# EAGLE board pcie-host (EAGLE 8.3.2), part 1 of 2
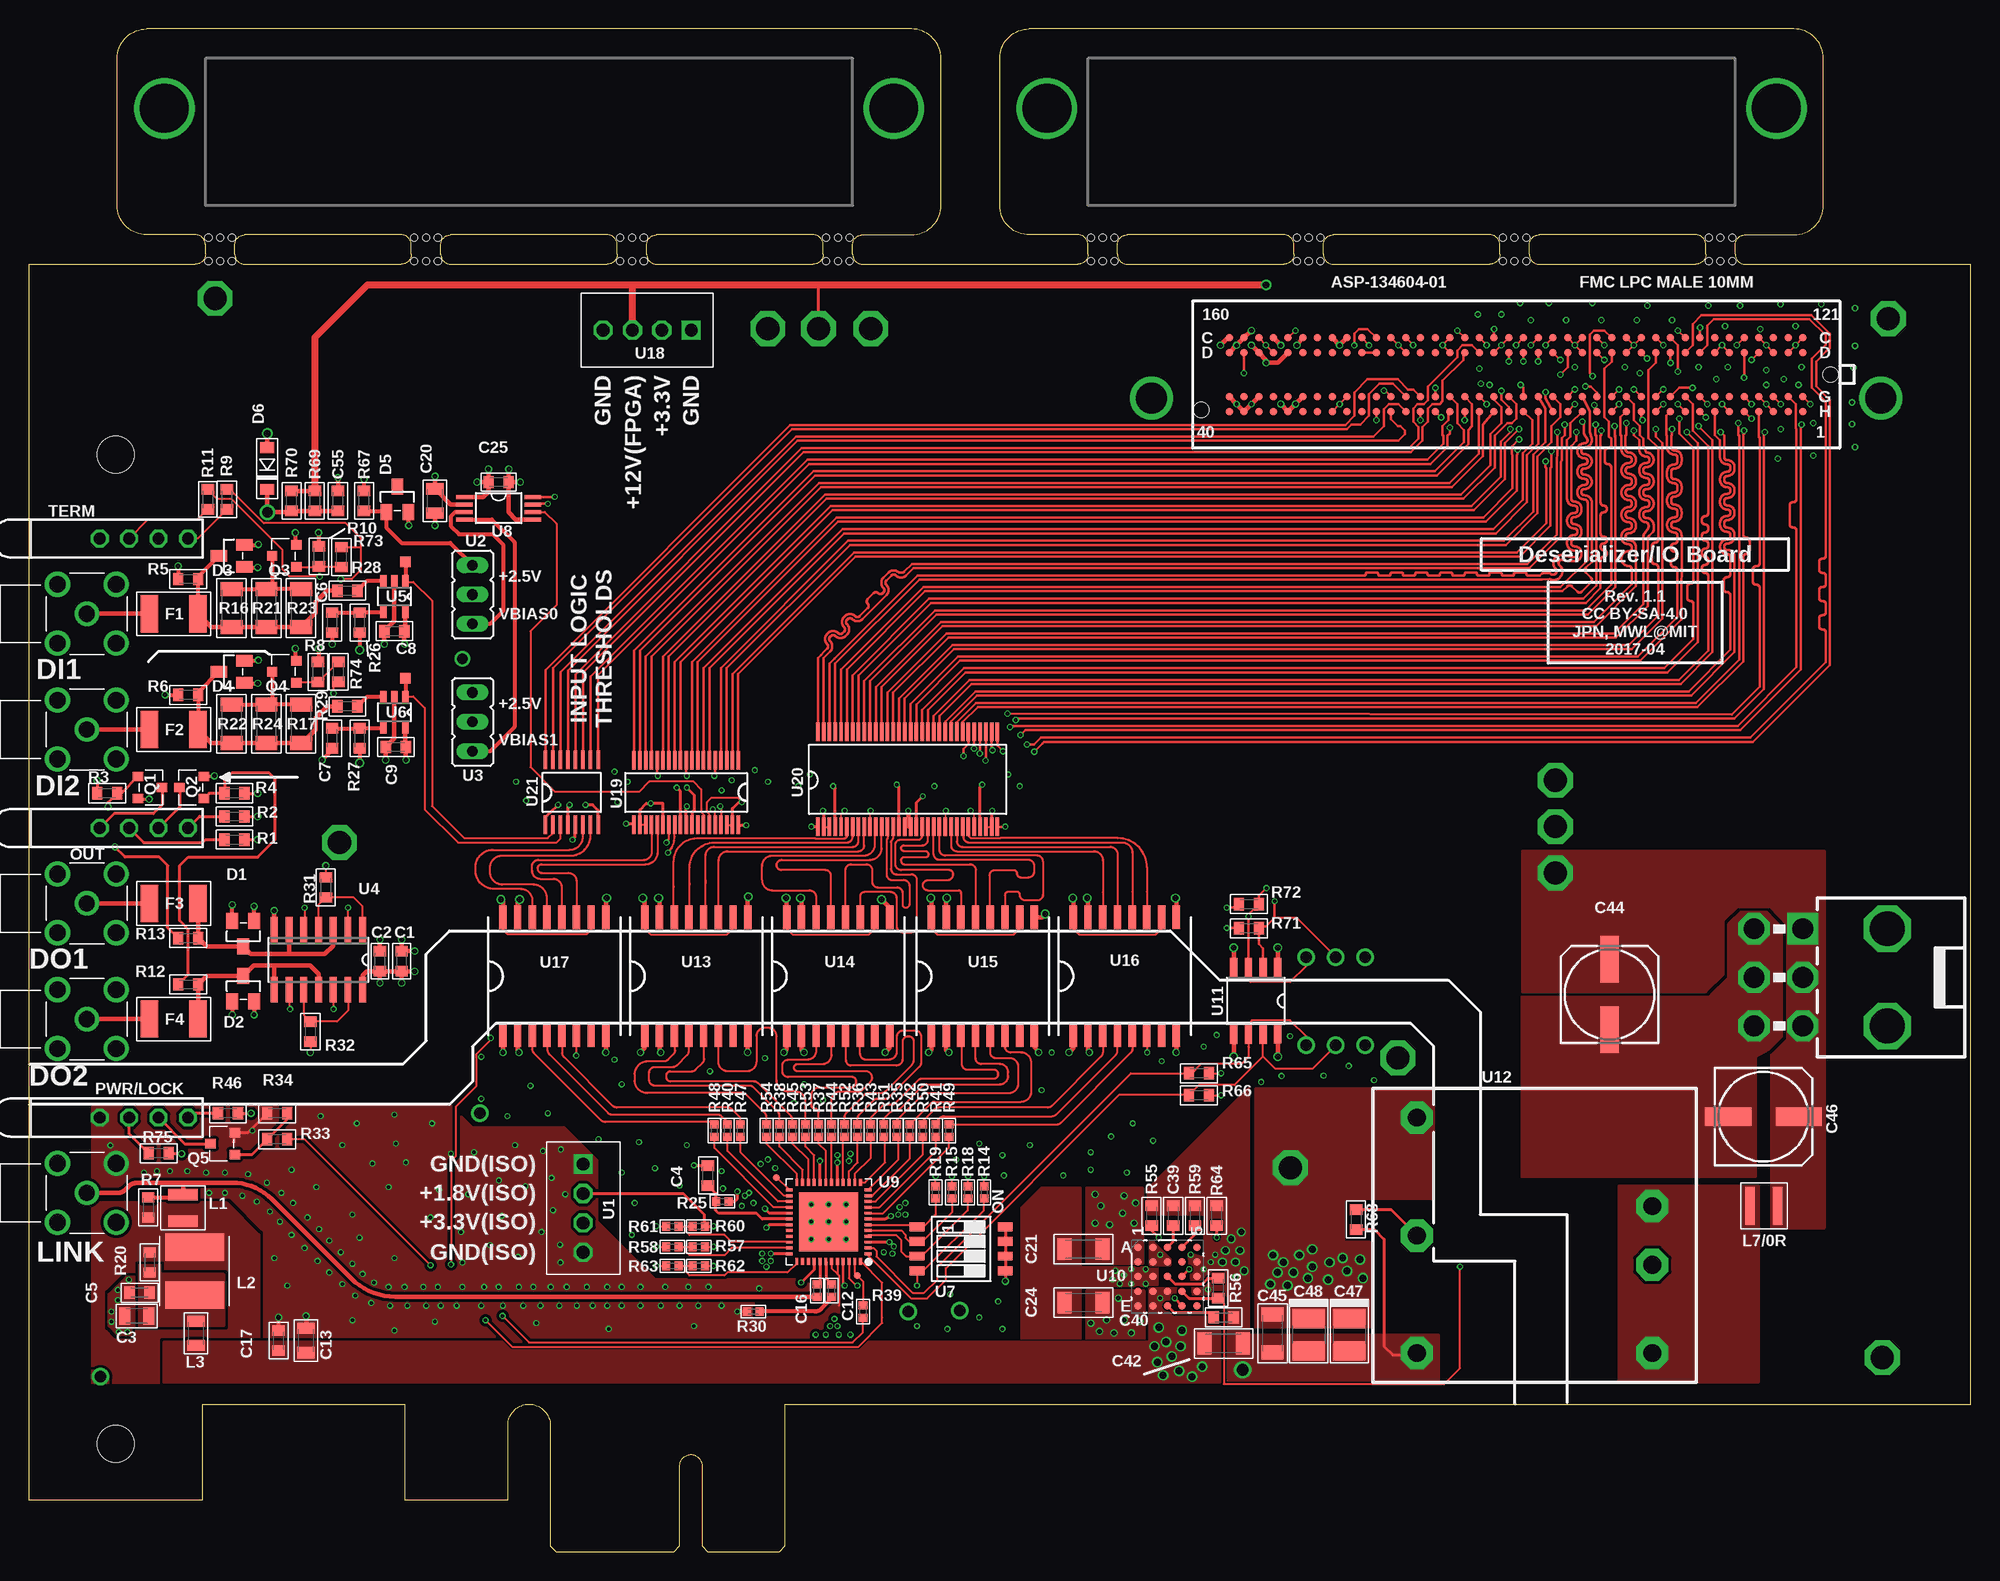
[diagram p5: board, top side]
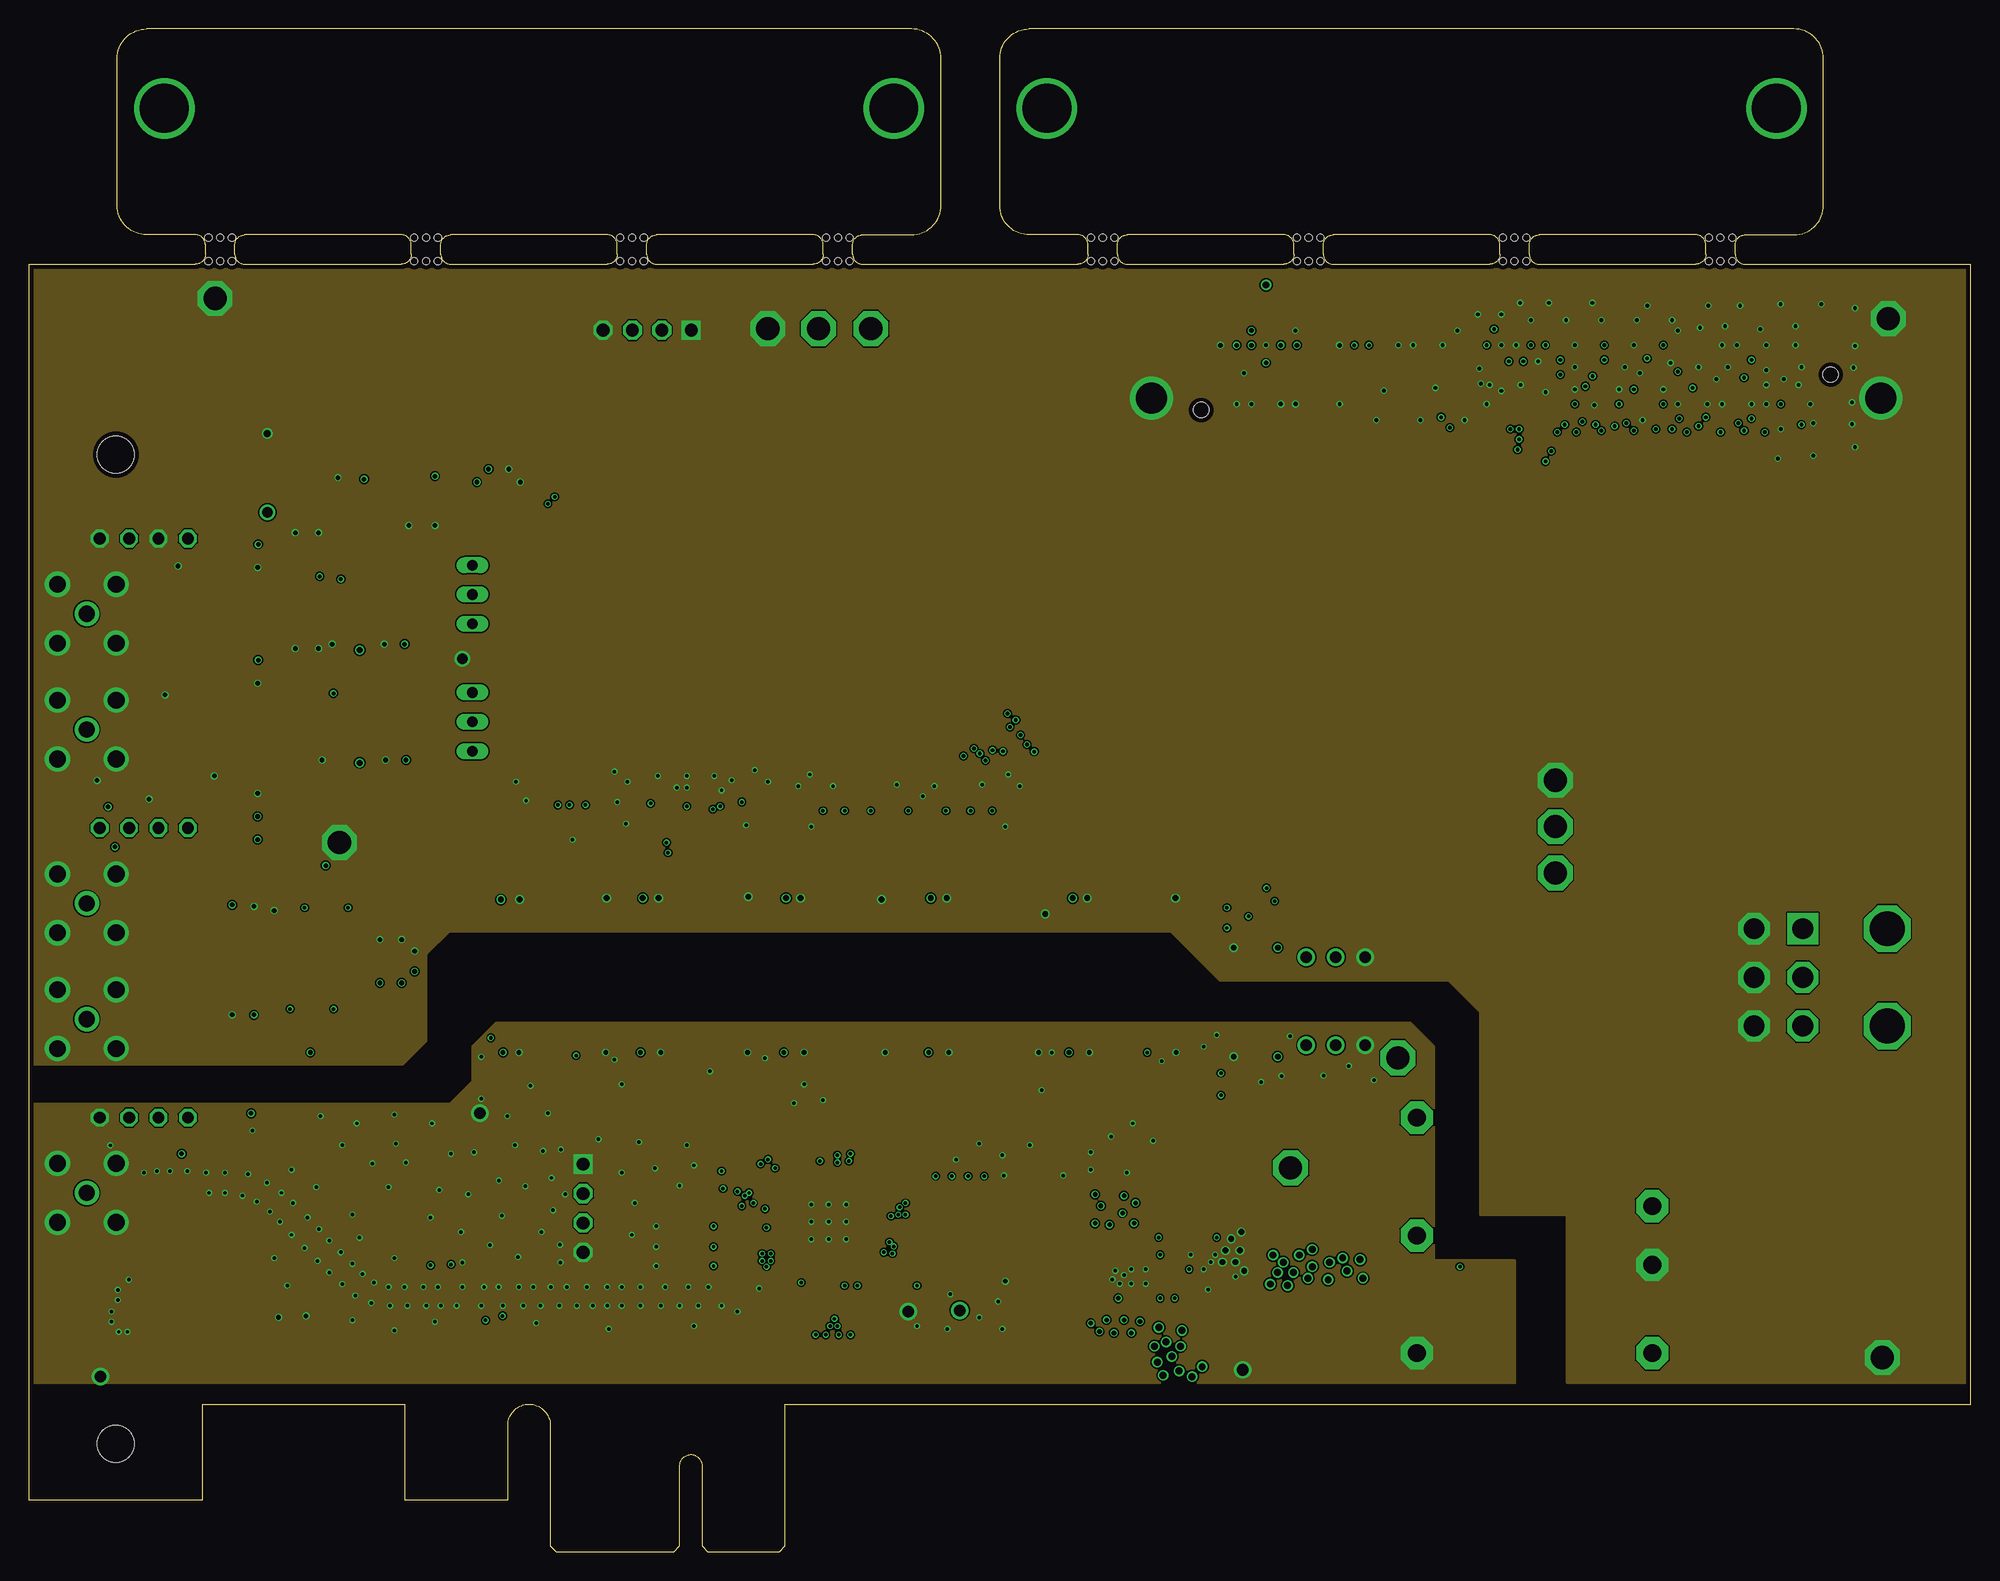
[diagram p6: board, inner layer Route2]
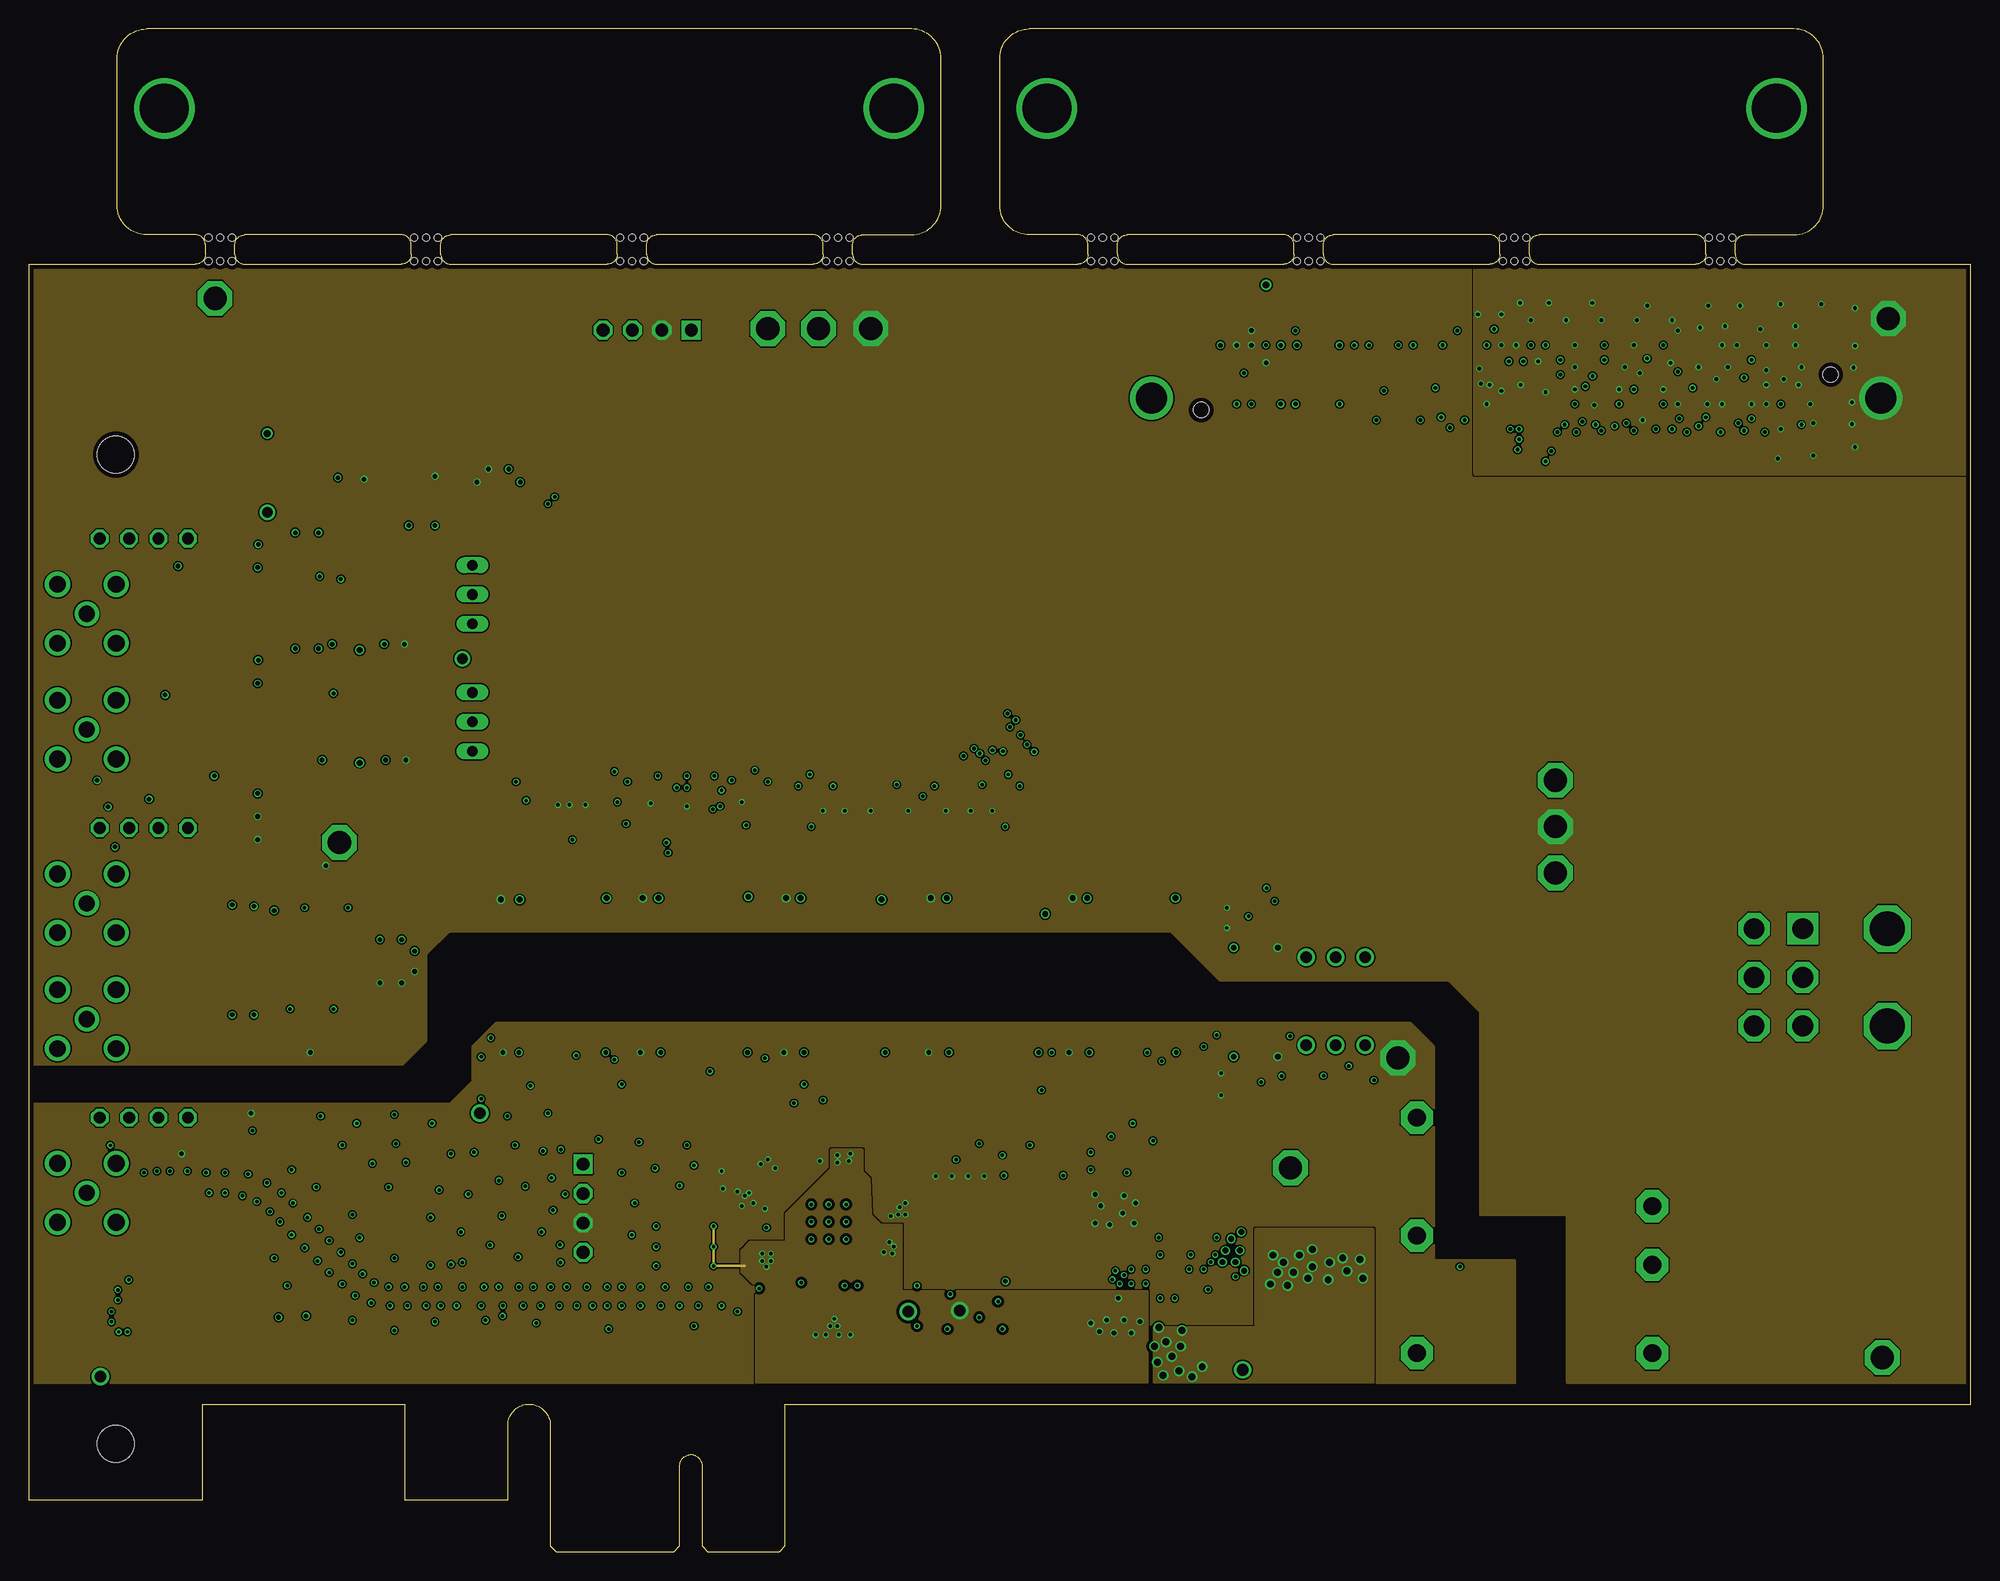
[diagram p7: board, inner layer Route15]
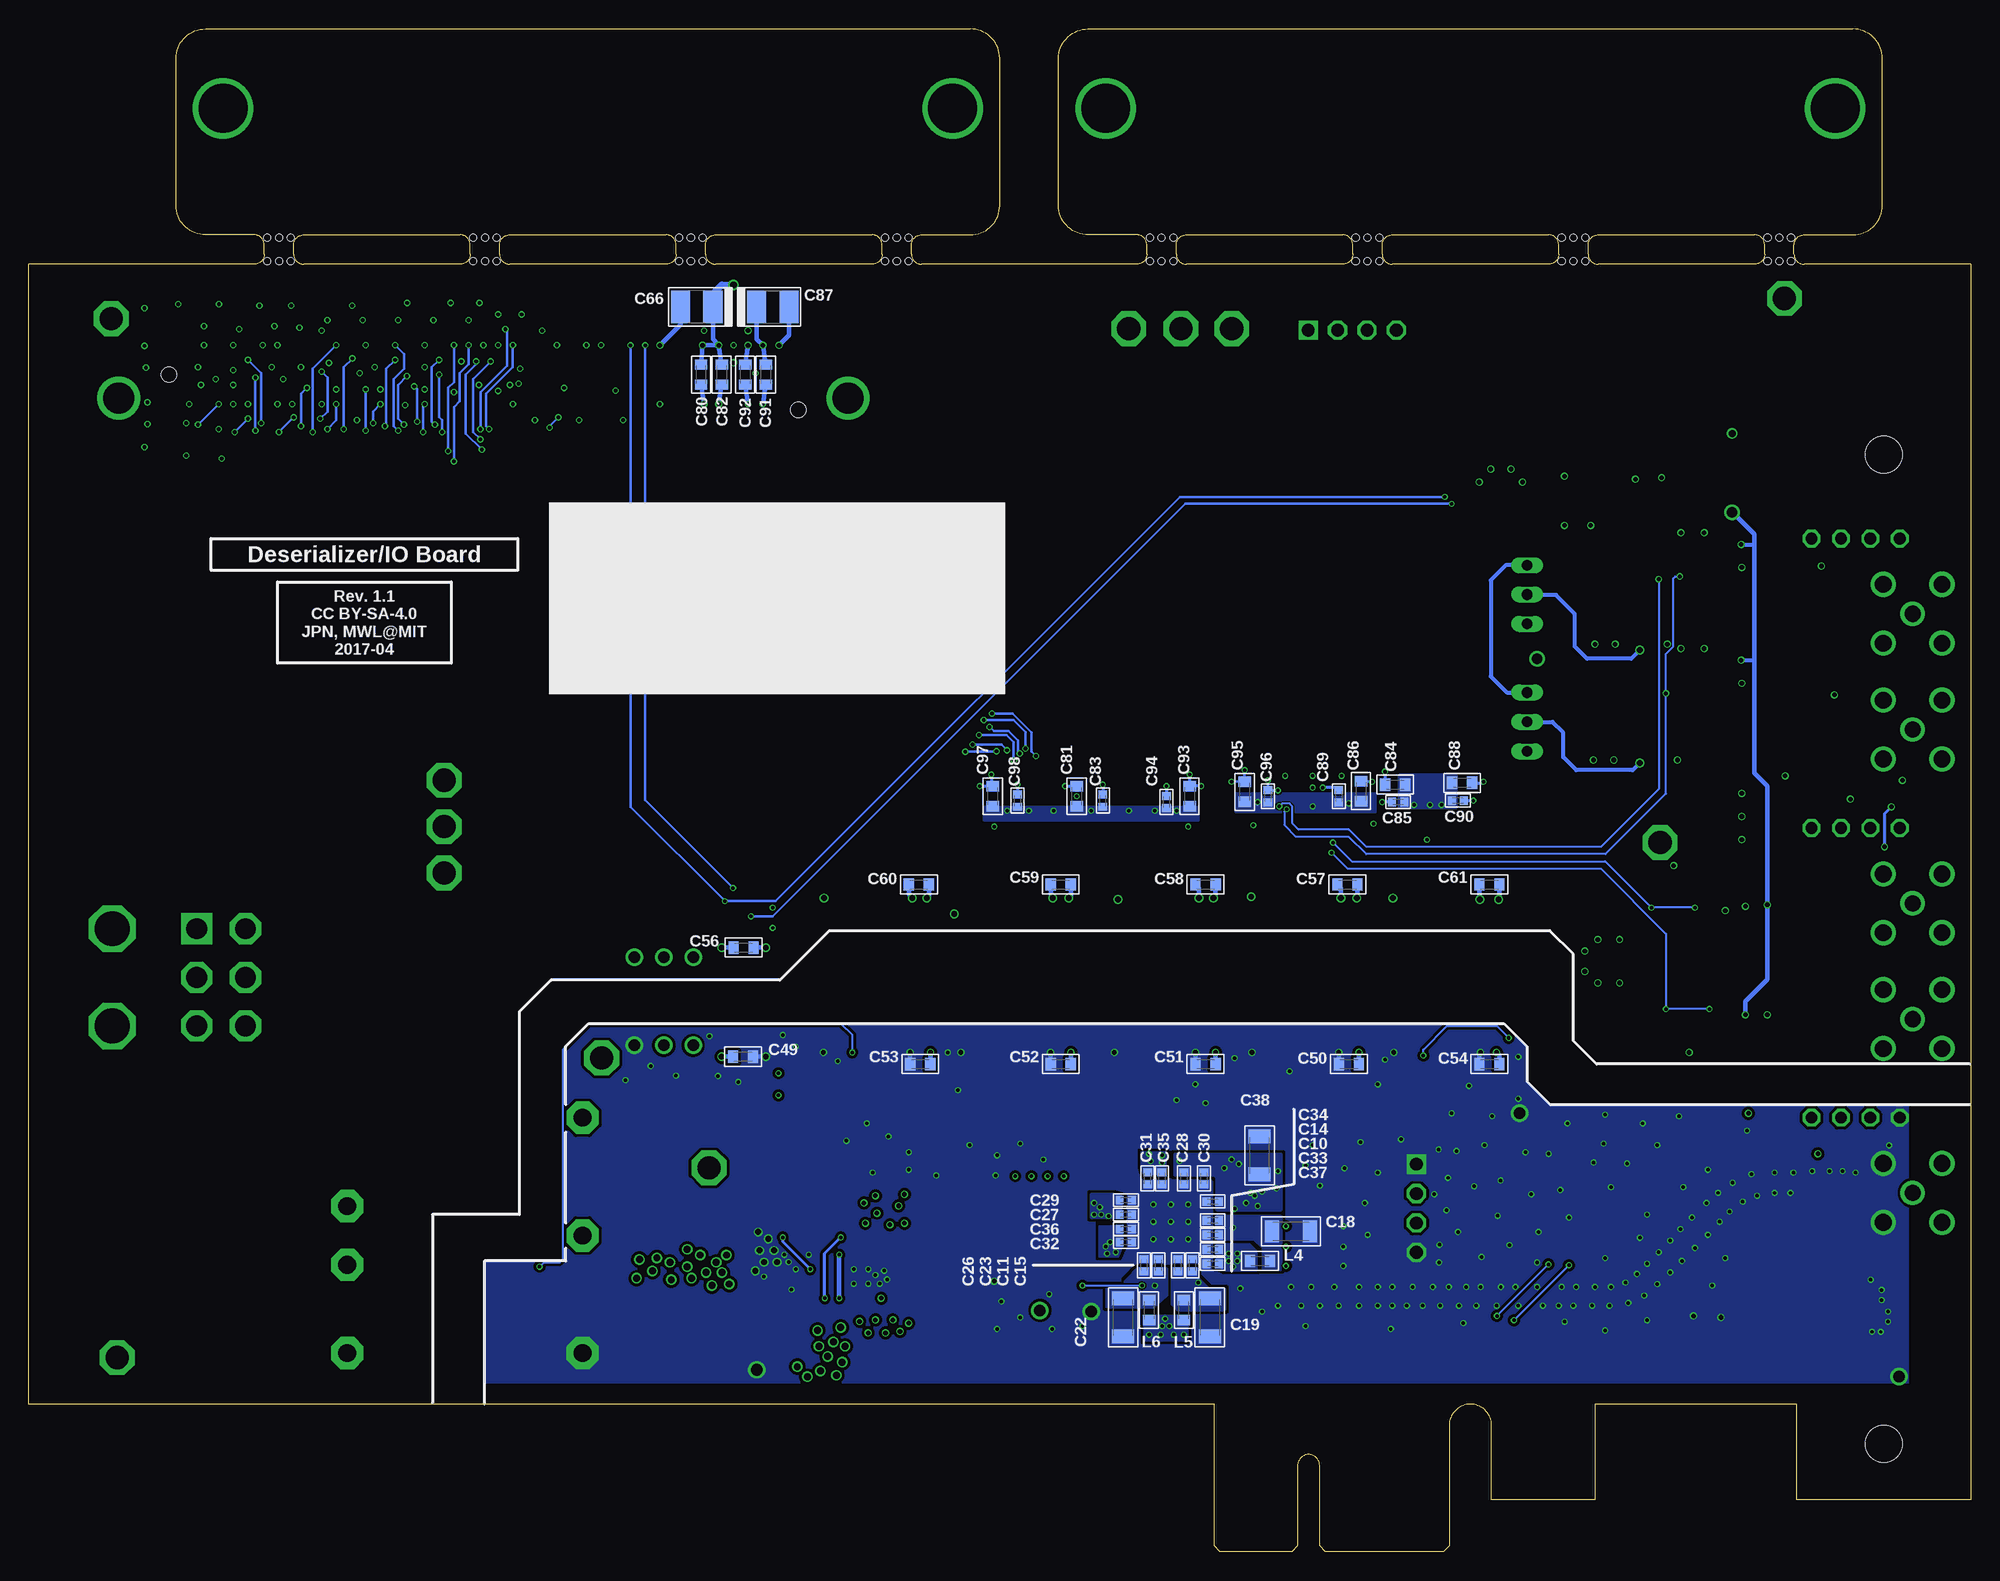
[diagram p8: board, bottom side, seen from below]

Size 167.64 x 131.5 mm. Coordinates in mm from the lower left corner, seen from the top.
Copper layers (1*2*15*16): Top 0.035559375mm / dielectric 0.17018125mm / Route2 0.01778125mm / dielectric 47mil / Route15 0.01778125mm / dielectric 0.17018125mm / Bottom 0.035559375mm
Design rules "ohs-park-4-layer *": minimum track width 5mil, minimum drill 0.3mm, track to track 5mil, track to pad 5mil, pad to pad 5mil, via to via 5mil, smd to smd 5mil, copper to edge 15mil, drill to drill 5mil, minimum pad ring 4mil, minimum via ring 4mil, stop-mask expansion 4mil, vias tented up to drill 100mil, thermal gap 10mil
Net classes: 1 diff: width 0.229 mm, drill 0.33 mm, clearance 0.127 mm

## Footprints (pad centres in the part's own frame; a part is rotated, then mirrored left to right if it is on the bottom)
0603 = smd 0.889 x 1.067: 1 -0.864,0; 2 0.864,0
0805 = smd 0.965 x 1.524: 1 -1.041,0; 2 1.041,0
0402 = smd 0.686 x 0.762: 1 -0.533,0; 2 0.533,0
1206 = smd 1.219 x 1.88: 1 -1.651,0; 2 1.651,0
153CLV-0807 = smd 4 x 1.6: + 3.05,0; - -3.05,0
1210-POL = smd 1.651 x 2.794: + -1.397,0; - 1.397,0
SOT23 = smd 1 x 1.4: 1 -0.95,-1.1; 2 0.95,-1.1; 3 0,1.1
SOD123 = smd 0.914 x 1.219: A -1.8,0; C 1.8,0
SMA_JACK_CONREVSMA002-G = drill 1.397: CLK 0,0 | drill 1.448: GND$1 -2.54,2.54; GND$2 2.54,2.54; GND$3 -2.54,-2.54; GND$4 2.54,-2.54
1812 = smd 1.5 x 3.2: 1 -2.1,0; 2 2.1,0
FMC_LPC_MALE_WITH_SP601_BSILK = drill 2.692: GNDA -31.496,2.032; GNDB 31.496,2.032 | smd 0.635 x 0.635 bottom: P$1 24.765,3.175; P$2 23.495,3.175; P$3 22.225,3.175; P$4 20.955,3.175; P$5 19.685,3.175; P$6 18.415,3.175; P$7 17.145,3.175; P$8 15.875,3.175; P$9 14.605,3.175; P$10 13.335,3.175; P$11 12.065,3.175; P$12 10.795,3.175; P$13 9.525,3.175; P$14 8.255,3.175; P$15 6.985,3.175; P$16 5.715,3.175; P$17 4.445,3.175; P$18 3.175,3.175; P$19 1.905,3.175; P$20 0.635,3.175; P$21 -0.635,3.175; P$22 -1.905,3.175; P$23 -3.175,3.175; P$24 -4.445,3.175; P$25 -5.715,3.175; P$26 -6.985,3.175; P$27 -8.255,3.175; P$28 -9.525,3.175; P$29 -10.795,3.175; P$30 -12.065,3.175; P$31 -13.335,3.175; P$32 -14.605,3.175; P$33 -15.875,3.175; P$34 -17.145,3.175; P$35 -18.415,3.175; P$36 -19.685,3.175; P$37 -20.955,3.175; P$38 -22.225,3.175; P$39 -23.495,3.175; P$40 -24.765,3.175; P$41 24.765,1.905; P$42 23.495,1.905; P$43 22.225,1.905; P$44 20.955,1.905; P$45 19.685,1.905; P$46 18.415,1.905; P$47 17.145,1.905; P$48 15.875,1.905; P$49 14.605,1.905; P$50 13.335,1.905; P$51 12.065,1.905; P$52 10.795,1.905; P$53 9.525,1.905; P$54 8.255,1.905; P$55 6.985,1.905; P$56 5.715,1.905; P$57 4.445,1.905; P$58 3.175,1.905; P$59 1.905,1.905; P$60 0.635,1.905; P$61 -0.635,1.905; P$62 -1.905,1.905; P$63 -3.175,1.905; P$64 -4.445,1.905; P$65 -5.715,1.905; P$66 -6.985,1.905; P$67 -8.255,1.905; P$68 -9.525,1.905; P$69 -10.795,1.905; P$70 -12.065,1.905; P$71 -13.335,1.905; P$72 -14.605,1.905; P$73 -15.875,1.905; P$74 -17.145,1.905; P$75 -18.415,1.905; P$76 -19.685,1.905; P$77 -20.955,1.905; P$78 -22.225,1.905; P$79 -23.495,1.905; P$80 -24.765,1.905; P$81 24.765,-1.905; P$82 23.495,-1.905; P$83 22.225,-1.905; P$84 20.955,-1.905; P$85 19.685,-1.905; P$86 18.415,-1.905; P$87 17.145,-1.905; P$88 15.875,-1.905; P$89 14.605,-1.905; P$90 13.335,-1.905; P$91 12.065,-1.905; P$92 10.795,-1.905; P$93 9.525,-1.905; P$94 8.255,-1.905; P$95 6.985,-1.905; P$96 5.715,-1.905; P$97 4.445,-1.905; P$98 3.175,-1.905; P$99 1.905,-1.905; P$100 0.635,-1.905; P$101 -0.635,-1.905; P$102 -1.905,-1.905; P$103 -3.175,-1.905; P$104 -4.445,-1.905; P$105 -5.715,-1.905; P$106 -6.985,-1.905; P$107 -8.255,-1.905; P$108 -9.525,-1.905; P$109 -10.795,-1.905; P$110 -12.065,-1.905; P$111 -13.335,-1.905; P$112 -14.605,-1.905; P$113 -15.875,-1.905; P$114 -17.145,-1.905; P$115 -18.415,-1.905; P$116 -19.685,-1.905; P$117 -20.955,-1.905; P$118 -22.225,-1.905; P$119 -23.495,-1.905; P$120 -24.765,-1.905; P$121 24.765,-3.175; P$122 23.495,-3.175; P$123 22.225,-3.175; P$124 20.955,-3.175; P$125 19.685,-3.175; P$126 18.415,-3.175; P$127 17.145,-3.175; P$128 15.875,-3.175; P$129 14.605,-3.175; P$130 13.335,-3.175; P$131 12.065,-3.175; P$132 10.795,-3.175; P$133 9.525,-3.175; P$134 8.255,-3.175; P$135 6.985,-3.175; P$136 5.715,-3.175; P$137 4.445,-3.175; P$138 3.175,-3.175; P$139 1.905,-3.175; P$140 0.635,-3.175; P$141 -0.635,-3.175; P$142 -1.905,-3.175; P$143 -3.175,-3.175; P$144 -4.445,-3.175; P$145 -5.715,-3.175; P$146 -6.985,-3.175; P$147 -8.255,-3.175; P$148 -9.525,-3.175; P$149 -10.795,-3.175; P$150 -12.065,-3.175; P$151 -13.335,-3.175; P$152 -14.605,-3.175; P$153 -15.875,-3.175; P$154 -17.145,-3.175; P$155 -18.415,-3.175; P$156 -19.685,-3.175; P$157 -20.955,-3.175; P$158 -22.225,-3.175; P$159 -23.495,-3.175; P$160 -24.765,-3.175 | hole 1.321: 27.165,0; -27.191,3.048
1008PS = smd 2.54 x 1.016: 1 0,1.143; 2 0,-1.143
SRN6045TA = smd 5.1 x 2.35: 1 0,2.075; 2 0,-2.075
4020 = smd 0.813 x 3.251: 1 -1.181,0; 2 1.181,0
569-011X-X00_LED_ARRAY = drill 1.016 octagon: A1 -6.35,0; A2 -1.27,0; C1 -8.89,0; C2 -3.81,0
PCIE-POWER-6PIN = drill 1.8 square: 1 -4.2,0 | drill 1.8 octagon: 2 0,0; 3 4.2,0; 4 -4.2,-4.2; 5 0,-4.2; 6 4.2,-4.2 | drill 3 octagon: P$7 -4.2,7.3; P$8 4.2,7.3
SOT23-GSD = smd 0.8 x 0.9: D 0,0; G -0.95,-2.1; S 0.95,-2.1
TESTPOINT_1MM = drill 1: 1 0,0
TESTPOINT_2MM = drill 2 octagon: 1 0,0
TP06R = smd 0.6 x 0.6: TP 0,0
TP09SQ = smd 0.9 x 0.9: TP 0,0
TESTPOINT_0.035IN = drill 0.9: 1 0,0
SCREW4 = drill 1.1 square: 1 0,0 | drill 1.1 octagon: 2 2.54,0; 3 5.08,0; 4 7.62,0
JP3 = drill 0.914 long: 1 0,0; 2 2.54,0; 3 5.08,0
SO14 = smd 0.6 x 2.2: 1 -3.81,-2.6; 2 -2.54,-2.6; 3 -1.27,-2.6; 4 0,-2.6; 5 1.27,-2.6; 6 2.54,-2.6; 7 3.81,-2.6; 8 3.81,2.6; 9 2.54,2.6; 10 1.27,2.6; 11 0,2.6; 12 -1.27,2.6; 13 -2.54,2.6; 14 -3.81,2.6
SOT-23-5 = smd 0.55 x 1: 1 -0.95,-1.35; 2 0,-1.35; 3 0.95,-1.35; 4 0.95,1.35; 5 -0.95,1.35
DIP04-SMD = smd 0.76 x 1.27: 1 0,-7.62; 2 1.27,-7.62; 3 2.54,-7.62; 4 3.81,-7.62; 5 3.81,0; 6 2.54,0; 7 1.27,0; 8 0,0
TSSOP-8 = smd 0.348 x 1.45: 1 -0.973,-2.95; 2 -0.323,-2.95; 3 0.327,-2.95; 4 0.977,-2.95; 5 0.977,2.95; 6 0.327,2.95; 7 -0.323,2.95; 8 -0.973,2.95
WQFN48 = smd 0.25 x 0.6: 1 2.75,3.4; 2 2.25,3.4; 3 1.75,3.4; 4 1.25,3.4; 5 0.75,3.4; 6 0.25,3.4; 7 -0.25,3.4; 8 -0.75,3.4; 9 -1.25,3.4; 10 -1.75,3.4; 11 -2.25,3.4; 12 -2.75,3.4; 25 -2.75,-3.4; 26 -2.25,-3.4; 27 -1.75,-3.4; 28 -1.25,-3.4; 29 -0.75,-3.4; 30 -0.25,-3.4; 31 0.25,-3.4; 32 0.75,-3.4; 33 1.25,-3.4; 34 1.75,-3.4; 35 2.25,-3.4; 36 2.75,-3.4 | smd 0.6 x 0.25: 13 -3.4,2.75; 14 -3.4,2.25; 15 -3.4,1.75; 16 -3.4,1.25; 17 -3.4,0.75; 18 -3.4,0.25; 19 -3.4,-0.25; 20 -3.4,-0.75; 21 -3.4,-1.25; 22 -3.4,-1.75; 23 -3.4,-2.25; 24 -3.4,-2.75; 37 3.4,-2.75; 38 3.4,-2.25; 39 3.4,-1.75; 40 3.4,-1.25; 41 3.4,-0.75; 42 3.4,-0.25; 43 3.4,0.25; 44 3.4,0.75; 45 3.4,1.25; 46 3.4,1.75; 47 3.4,2.25; 48 3.4,2.75 | smd 5.1 x 5.1: 49 0,0
BGA_5X5_625X625 = smd 0.635 x 0.635: A1 -2.54,2.54; A2 -1.27,2.54; A3 0,2.54; A4 1.27,2.54; A5 2.54,2.54; B1 -2.54,1.27; B2 -1.27,1.27; B3 0,1.27; B4 1.27,1.27; B5 2.54,1.27; C1 -2.54,0; C2 -1.27,0; C3 0,0; C4 1.27,0; C5 2.54,0; D1 -2.54,-1.27; D2 -1.27,-1.27; D3 0,-1.27; D4 1.27,-1.27; D5 2.54,-1.27; E1 -2.54,-2.54; E2 -1.27,-2.54; E3 0,-2.54; E4 1.27,-2.54; E5 2.54,-2.54
SOIC127P500X400-8N = smd 1.778 x 0.635: 1 -2.819,1.905; 2 -2.819,0.635; 3 -2.819,-0.635; 4 -2.819,-1.905; 5 2.819,-1.905; 6 2.819,-0.635; 7 2.819,0.635; 8 2.794,1.905
UEI15 = drill 1.524 pad 2.794 octagon: 1 10.16,2.54; 2 10.16,-2.54; 3 -10.16,10.16; 4 -10.16,0; 5 -10.16,-10.16; 6 10.16,-10.16
SOIC_WIDE_16 = smd 0.635 x 2.032: P1 -4.445,-5.08; P2 -3.175,-5.08; P3 -1.905,-5.08; P4 -0.635,-5.08; P5 0.635,-5.08; P6 1.905,-5.08; P7 3.175,-5.08; P8 4.445,-5.08; P9 4.445,5.08; P10 3.175,5.08; P11 1.905,5.08; P12 0.635,5.08; P13 -0.635,5.08; P14 -1.905,5.08; P15 -3.175,5.08; P16 -4.445,5.08
TSSOP-38 = smd 1.6 x 0.3: 1 -2.8,7.75; 2 -2.8,7.25; 3 -2.8,6.75; 4 -2.8,6.25; 5 -2.8,5.75; 6 -2.8,5.25; 7 -2.8,4.75; 8 -2.8,4.25; 9 -2.8,3.75; 10 -2.8,3.25; 11 -2.8,2.75; 12 -2.8,2.25; 13 -2.8,1.75; 14 -2.8,1.25; 15 -2.8,0.75; 16 -2.8,0.25; 17 -2.8,-0.25; 18 -2.8,-0.75; 19 -2.8,-1.25; 20 2.8,-1.25; 21 2.8,-0.75; 22 2.8,-0.25; 23 2.8,0.25; 24 2.8,0.75; 25 2.8,1.25; 26 2.8,1.75; 27 2.8,2.25; 28 2.8,2.75; 29 2.8,3.25; 30 2.8,3.75; 31 2.8,4.25; 32 2.8,4.75; 33 2.8,5.25; 34 2.8,5.75; 35 2.8,6.25; 36 2.8,6.75; 37 2.8,7.25; 38 2.8,7.75
TSSOP-64 = smd 1.6 x 0.3: 1 -4.1,7.75; 2 -4.1,7.25; 3 -4.1,6.75; 4 -4.1,6.25; 5 -4.1,5.75; 6 -4.1,5.25; 7 -4.1,4.75; 8 -4.1,4.25; 9 -4.1,3.75; 10 -4.1,3.25; 11 -4.1,2.75; 12 -4.1,2.25; 13 -4.1,1.75; 14 -4.1,1.25; 15 -4.1,0.75; 16 -4.1,0.25; 17 -4.1,-0.25; 18 -4.1,-0.75; 19 -4.1,-1.25; 20 -4.1,-1.75; 21 -4.1,-2.25; 22 -4.1,-2.75; 23 -4.1,-3.25; 24 -4.1,-3.75; 25 -4.1,-4.25; 26 -4.1,-4.75; 27 -4.1,-5.25; 28 -4.1,-5.75; 29 -4.1,-6.25; 30 -4.1,-6.75; 31 -4.1,-7.25; 32 -4.1,-7.75; 33 4.1,-7.75; 34 4.1,-7.25; 35 4.1,-6.75; 36 4.1,-6.25; 37 4.1,-5.75; 38 4.1,-5.25; 39 4.1,-4.75; 40 4.1,-4.25; 41 4.1,-3.75; 42 4.1,-3.25; 43 4.1,-2.75; 44 4.1,-2.25; 45 4.1,-1.75; 46 4.1,-1.25; 47 4.1,-0.75; 48 4.1,-0.25; 49 4.1,0.25; 50 4.1,0.75; 51 4.1,1.25; 52 4.1,1.75; 53 4.1,2.25; 54 4.1,2.75; 55 4.1,3.25; 56 4.1,3.75; 57 4.1,4.25; 58 4.1,4.75; 59 4.1,5.25; 60 4.1,5.75; 61 4.1,6.25; 62 4.1,6.75; 63 4.1,7.25; 64 4.1,7.75
TSSOP-16 = smd 1.6 x 0.3: 1 -2.8,2.275; 2 -2.8,1.625; 3 -2.8,0.975; 4 -2.8,0.325; 5 -2.8,-0.325; 6 -2.8,-0.975; 7 -2.8,-1.625; 8 -2.8,-2.275; 9 2.8,-2.275; 10 2.8,-1.625; 11 2.8,-0.975; 12 2.8,-0.325; 13 2.8,0.325; 14 2.8,0.975; 15 2.8,1.625; 16 2.8,2.275
MOLEX_743370911_SD_DUAL_STACKED_VHDCI = drill 0.65: P$1 13.005,8.55; P$2 12.205,7.4; P$3 11.405,8.55; P$4 10.605,7.4; P$5 9.805,8.55; P$6 9.005,7.4; P$7 8.205,8.55; P$8 7.405,7.4; P$9 6.605,8.55; P$10 5.805,7.4; P$11 5.005,8.55; P$12 4.205,7.4; P$13 3.405,8.55; P$14 2.605,7.4; P$15 1.805,8.55; P$16 1.005,7.4; P$17 0.205,8.55; P$18 -0.595,7.4; P$19 -1.395,8.55; P$20 -2.195,7.4; P$21 -2.995,8.55; P$22 -3.795,7.4; P$23 -4.595,8.55; P$24 -5.395,7.4; P$25 -6.195,8.55; P$26 -6.995,7.4; P$27 -7.795,8.55; P$28 -8.595,7.4; P$29 -9.395,8.55; P$30 -10.195,7.4; P$31 -10.995,8.55; P$32 -11.795,7.4; P$33 -12.595,8.55; P$34 -13.395,7.4; P$35 13.405,6.2; P$36 12.605,5.05; P$37 11.805,6.2; P$38 11.005,5.05; P$39 10.205,6.2; P$40 9.405,5.05; P$41 8.605,6.2; P$42 7.805,5.05; P$43 7.005,6.2; P$44 6.205,5.05; P$45 5.405,6.2; P$46 4.605,5.05; P$47 3.805,6.2; P$48 3.005,5.05; P$49 2.205,6.2; P$50 1.405,5.05; P$51 0.605,6.2; P$52 -0.195,5.05; P$53 -0.995,6.2; P$54 -1.795,5.05; P$55 -2.595,6.2; P$56 -3.395,5.05; P$57 -4.195,6.2; P$58 -4.995,5.05; P$59 -5.795,6.2; P$60 -6.595,5.05; P$61 -7.395,6.2; P$62 -8.195,5.05; P$63 -8.995,6.2; P$64 -9.795,5.05; P$65 -10.595,6.2; P$66 -11.395,5.05; P$67 -12.195,6.2; P$68 -12.995,5.05; Q$1 -13.195,13.63; Q$2 -12.395,14.78; Q$3 -11.595,13.63; Q$4 -10.795,14.78; Q$5 -9.995,13.63; Q$6 -9.195,14.78; Q$7 -8.395,13.63; Q$8 -7.595,14.78; Q$9 -6.795,13.63; Q$10 -5.995,14.78; Q$11 -5.195,13.63; Q$12 -4.395,14.78; Q$13 -3.595,13.63; Q$14 -2.795,14.78; Q$15 -1.995,13.63; Q$16 -1.195,14.78; Q$17 -0.395,13.63; Q$18 0.405,14.78; Q$19 1.205,13.63; Q$20 2.005,14.78; Q$21 2.805,13.63; Q$22 3.605,14.78; Q$23 4.405,13.63; Q$24 5.205,14.78; Q$25 6.005,13.63; Q$26 6.805,14.78; Q$27 7.605,13.63; Q$28 8.405,14.78; Q$29 9.205,13.63; Q$30 10.005,14.78; Q$31 10.805,13.63; Q$32 11.605,14.78; Q$33 12.405,13.63; Q$34 13.205,14.78; Q$35 -13.195,15.98; Q$36 -12.395,17.13; Q$37 -11.595,15.98; Q$38 -10.795,17.13; Q$39 -9.995,15.98; Q$40 -9.195,17.13; Q$41 -8.395,15.98; Q$42 -7.595,17.13; Q$43 -6.795,15.98; Q$44 -5.995,17.13; Q$45 -5.195,15.98; Q$46 -4.395,17.13; Q$47 -3.595,15.98; Q$48 -2.795,17.13; Q$49 -1.995,15.98; Q$50 -1.195,17.13; Q$51 -0.395,15.98; Q$52 0.405,17.13; Q$53 1.205,15.98; Q$54 2.005,17.13; Q$55 2.805,15.98; Q$56 3.605,17.13; Q$57 4.405,15.98; Q$58 5.205,17.13; Q$59 6.005,15.98; Q$60 6.805,17.13; Q$61 7.605,15.98; Q$62 8.405,17.13; Q$63 9.205,15.98; Q$64 10.005,17.13; Q$65 10.805,15.98; Q$66 11.605,17.13; Q$67 12.405,15.98; Q$68 13.205,17.13 | hole 1.2: -16.175,6.3; 16.175,6.3; -16.175,17.13; 16.175,17.13 | hole 1.75: -20.95,3.68; 20.95,3.68
PCI-ADDIN_STD-H_HALF-L_FMC-STRAIN = drill 4.216: GNDA 11.684,120.142; GNDA1 87.884,120.142; GNDB 74.676,120.142; GNDB1 150.876,120.142 | hole 3.175: 7.5,4.85; 7.5,90.246 | hole 0.6: 15.494,108.966; 16.51,108.966; 17.526,108.966; 15.494,106.934; 16.51,106.934; 17.526,106.934; 33.274,108.966; 34.29,108.966; 35.306,108.966; 33.274,106.934; 34.29,106.934; 35.306,106.934; 51.054,108.966; 52.07,108.966; 53.086,108.966; 51.054,106.934; 52.07,106.934; 53.086,106.934; 68.834,108.966; 69.85,108.966; 70.866,108.966; 68.834,106.934; 69.85,106.934; 70.866,106.934; 91.694,108.966; 92.71,108.966; 93.726,108.966; 91.694,106.934; 92.71,106.934; 93.726,106.934; 109.474,108.966; 110.49,108.966; 111.506,108.966; 109.474,106.934; 110.49,106.934; 111.506,106.934; 127.254,108.966; 128.27,108.966; 129.286,108.966; 127.254,106.934; 128.27,106.934; 129.286,106.934; 145.034,108.966; 146.05,108.966; 147.066,108.966; 145.034,106.934; 146.05,106.934; 147.066,106.934

## Placement (x,y rotation side)
C1  1uF  [0603]  32.18,50.99 270 top
C2  0.1uF  [0603]  30.3,50.99 270 top
C3  4.7uF  [0805]  9.3,20.37 0 top
C4  10uF  [0603]  58.62,32.5 270 top
C5  0.1uF  [0603]  9.55,22.37 180 top
C6  0.1uF  [0603]  26.18,80.24 270 top
C7  0.1uF  [0603]  26.18,70.24 270 top
C8  0.1uF  [0603]  31.55,79.49 180 top
C9  0.1uF  [0603]  31.68,69.49 180 top
C10  10nF  [0402]  65.43,27.37 0 bottom
C11  10nF  [0402]  68.43,24.74 270 bottom
C12  47nF  [0402]  69.3,22.57 270 top
C13  4.7uF  [0805]  23.93,18.24 270 top
C14  0.1uF  [0402]  65.43,28.62 0 bottom
C15  0.1uF  [0402]  67.18,24.74 270 bottom
C16  0.1uF  [0402]  68.05,22.57 270 top
C17  0.1uF  [0603]  21.55,18.24 90 top
C18  4.7uF  [1206]  58.67,27.67 180 bottom
C19  4.7F  [1206]  65.68,20.24 90 bottom
C20  1uF  [0805]  35.05,90.74 90 top
C21  22uF  [1206]  91.05,26.14 0 top
C22  4.7uF  [1206]  73.18,20.24 90 bottom
C23  0.1uF  [0402]  70.12,24.74 270 bottom
C24  22uF  [1206]  91.05,21.52 0 top
C25  0.1uF  [0603]  40.55,92.37 180 top
C26  10nF  [0402]  71.37,24.74 270 bottom
C27  10nF  [0402]  72.93,29.12 180 bottom
C28  10nF  [0402]  67.93,32.24 90 bottom
C29  0.1uF  [0402]  72.93,30.37 180 bottom
C30  10nF  [0402]  66.18,32.24 90 bottom
C31  10nF  [0402]  71.05,32.24 90 bottom
C32  10nF  [0402]  72.93,26.74 180 bottom
C33  10nF  [0402]  65.43,26.12 0 bottom
C34  0.1uF  [0402]  65.43,30.24 0 bottom
C35  0.1uF  [0402]  69.8,32.24 90 bottom
C36  0.1uF  [0402]  72.93,27.87 180 bottom
C37  0.1uF  [0402]  65.43,24.87 0 bottom
C38  4.7uF  [1206]  61.39,34.24 270 bottom
C39  0.1uF  [0603]  98.8,29.02 270 top
C40  0.1uF  [0603]  103.15,20.24 180 top
C42  10uF  [1206]  103.15,17.99 180 top
C44  100uF  [153CLV-0807]  136.47,48.13 90 top
C45  10uF  [1206]  107.37,18.87 90 top
C46  47uF  [153CLV-0807]  149.76,37.57 0 top
C47  22uF  [1210-POL]  114,18.75 270 top
C48  22uF  [1210-POL]  110.5,18.75 270 top
C49  0.1uF  [0603]  105.98,42.76 180 bottom
C50  0.1uF  [0603]  53.68,42.12 0 bottom
C51  0.1uF  [0603]  66.05,42.12 0 bottom
C52  0.1uF  [0603]  78.55,42.12 0 bottom
C53  0.1uF  [0603]  90.68,42.12 0 bottom
C54  0.1uF  [0603]  41.55,42.12 0 bottom
C55  0.1uF  [0603]  26.68,90.74 270 top
C56  0.1uF  [0603]  105.94,52.17 180 bottom
C57  0.1uF  [0603]  53.8,57.62 0 bottom
C58  0.1uF  [0603]  66.05,57.62 0 bottom
C59  0.1uF  [0603]  78.55,57.62 0 bottom
C60  0.1uF  [0603]  90.8,57.62 0 bottom
C61  0.1uF  [0603]  41.55,57.62 0 bottom
C66  22uF  [1210-POL]  109.99,107.49 180 bottom
C80  0.1uF  [0603]  109.61,101.65 90 bottom
C81  0.1uF  [0603]  77.18,65.24 270 bottom
C82  0.1uF  [0603]  107.83,101.65 90 bottom
C83  1nF  [0402]  74.93,64.87 270 bottom
C84  0.1uF  [0603]  49.68,66.24 0 bottom
C85  1nF  [0402]  49.43,64.74 0 bottom
C86  0.1uF  [0603]  52.63,65.69 270 bottom
C87  22uF  [1210-POL]  103.42,107.5 0 bottom
C88  0.1uF  [0603]  43.89,66.4 180 bottom
C89  1nF  [0402]  54.55,65.24 270 bottom
C90  1nF  [0402]  44.27,64.86 180 bottom
C91  0.1uF  [0603]  104.02,101.65 90 bottom
C92  0.1uF  [0603]  105.8,101.65 90 bottom
C93  0.1uF  [0603]  67.43,65.24 270 bottom
C94  1nF  [0402]  69.43,64.74 270 bottom
C95  0.1uF  [0603]  62.68,65.62 270 bottom
C96  1nF  [0402]  60.68,65.24 270 bottom
C97  0.1uF  [0603]  84.43,65.24 270 bottom
C98  1nF  [0402]  82.3,64.87 270 bottom
D1  BAR66  [SOT23]  18.5,53.37 180 top
D2  BAR66  [SOT23]  18.5,48.62 0 top
D3  BAR66  [SOT23]  17.5,86 90 top
D4  BAR66  [SOT23]  17.5,76 90 top
D5  LM4040D25FTA  [SOT23]  31.8,90.87 0 top
D6  KDZ4.3B  [SOD123]  20.58,93.54 270 top
DI1  SMA002  [SMA_JACK_CONREVSMA002-G]  5,81 0 top
DI2  SMA002  [SMA_JACK_CONREVSMA002-G]  5,71 0 top
DO1  SMA002  [SMA_JACK_CONREVSMA002-G]  5,56 0 top
DO2  SMA002  [SMA_JACK_CONREVSMA002-G]  5,46 0 top
F1  C014F-2  [1812]  12.5,81 0 top
F2  C014F-2  [1812]  12.5,71 0 top
F3  C014F-2  [1812]  12.5,56 0 top
F4  C014F-2  [1812]  12.5,46 0 top
FMC_LPC  FMC_LPC_160_PIN  [FMC_LPC_MALE_WITH_SP601_BSILK]  128.41,101.65 180 bottom
L1  1008PS-472KLB  [1008PS]  13.3,29.69 180 top
L2  SRN6045TA-101M  [SRN6045TA]  14.3,24.24 180 top
L3  MPZ2012S102AT000  [0805]  14.43,18.87 90 top
L4  BLM18KG601SN1D  [0603]  61.35,25.12 180 bottom
L5  BLM18KG601SN1D  [0603]  67.93,20.87 270 bottom
L6  BLM18KG601SN1D  [0603]  70.93,20.87 90 bottom
L7/0R  74438356010  [4020]  149.8,29.87 180 top
LINK  SMA002  [SMA_JACK_CONREVSMA002-G]  5,31 0 top
OUT  569-011x  [569-011X-X00_LED_ARRAY]  15,62.5 0 top
PCIE-PWR  0455580003  [PCIE-POWER-6PIN]  153.15,49.61 270 top
PWR/LOCK  569-011x  [569-011X-X00_LED_ARRAY]  15,37.5 0 top
Q1  NDS351AN  [SOT23-GSD]  11.5,66 270 top
Q2  NDS351AN  [SOT23-GSD]  13,66 90 top
Q3  BSH103  [SOT23-GSD]  21,86 90 top
Q4  BSH103  [SOT23-GSD]  21,76 90 top
Q5  NDS351AN  [SOT23-GSD]  15.68,35.24 90 top
R1  1k  [0603]  17.75,61.5 0 top
R2  1k  [0603]  17.75,63.5 0 top
R3  100k  [0603]  6.75,65.5 0 top
R4  100k  [0603]  17.75,65.5 180 top
R5  2.2k  [0603]  13.75,84 0 top
R6  2.2k  [0603]  13.75,74 0 top
R7  1K  [0603]  10.3,29.74 90 top
R8  100k  [0603]  24.95,75.98 270 top
R9  1k  [0603]  17.1,90.88 270 top
R10  100k  [0603]  25.04,85.96 270 top
R11  1k  [0603]  15.44,90.88 270 top
R12  4.7k  [0603]  13.75,49 0 top
R13  4.7k  [0603]  13.75,53 0 top
R14  10K  [0402]  82.48,31.03 90 top
R15  10K  [0402]  79.68,31.03 90 top
R16  150,0.25W  [1206]  17.5,81.5 270 top
R17  150,0.25W  [1206]  23.5,71.5 270 top
R18  10K  [0402]  81.08,31.03 90 top
R19  10K  [0402]  78.29,31.03 90 top
R20  1K  [0603]  10.43,24.99 90 top
R21  150,0.25W  [1206]  20.5,81.5 270 top
R22  150,0.25W  [1206]  17.5,71.5 270 top
R23  150,0.25W  [1206]  23.5,81.5 270 top
R24  150,0.25W  [1206]  20.5,71.5 270 top
R25  10K  [0402]  59.87,30.25 180 top
R26  10k  [0603]  28.55,80.24 90 top
R27  10k  [0603]  28.55,70.24 90 top
R28  100  [0603]  27.5,83 0 top
R29  100  [0603]  27.5,73 0 top
R30  49.9  [0402]  62.55,20.74 180 top
R31  2.2k  [0603]  25.62,57.37 90 top
R32  2.2k  [0603]  24.3,44.92 270 top
R33  1k  [0603]  21.43,35.62 0 top
R34  100k  [0603]  21.43,37.87 0 top
R35  22  [0402]  74.93,36.37 270 top
R36  22  [0402]  71.55,36.37 270 top
R37  22  [0402]  68.18,36.37 270 top
R38  22  [0402]  64.8,36.37 270 top
R39  22  [0402]  72.01,20.75 90 top
R40  22  [0402]  60.3,36.37 270 top
R41  22  [0402]  78.3,36.37 270 top
R42  22  [0402]  76.05,36.37 270 top
R43  22  [0402]  72.68,36.37 270 top
R44  22  [0402]  69.3,36.37 270 top
R45  22  [0402]  65.93,36.37 270 top
R46  1k  [0603]  17.18,37.87 0 top
R47  22  [0402]  61.43,36.37 270 top
R48  22  [0402]  59.18,36.37 270 top
R49  22  [0402]  79.43,36.37 270 top
R50  22  [0402]  77.18,36.37 270 top
R51  22  [0402]  73.8,36.37 270 top
R52  22  [0402]  70.43,36.37 270 top
R53  22  [0402]  67.05,36.37 270 top
R54  22  [0402]  63.68,36.37 270 top
R55  30.1k  [0603]  96.93,29.02 90 top
R56  10k  [0603]  102.68,22.77 270 top
R57  10K  [0402]  57.84,26.34 180 top
R58  0  [0402]  55.55,26.34 180 top
R59  13.3k  [0603]  100.68,29.02 90 top
R60  10K  [0402]  57.84,28.11 180 top
R61  0  [0402]  55.55,28.11 180 top
R62  10K  [0402]  57.84,24.68 180 top
R63  0  [0402]  55.55,24.68 180 top
R64  649k  [0603]  102.55,29.02 90 top
R65  1k  [0603]  101.02,41.32 0 top
R66  1k  [0603]  101.02,39.42 0 top
R67  100  [0603]  28.93,90.74 90 top
R68  9.53k  [0603]  114.58,28.7 270 top
R69  2.2k  [0603]  24.68,90.74 90 top
R70  2.2k  [0603]  22.68,90.74 90 top
R71  1k  [0603]  105.33,53.83 180 top
R72  1k  [0603]  105.33,55.93 180 top
R73  1k  [0603]  26.98,85.9 270 top
R74  1k  [0603]  26.73,75.99 90 top
R75  1k  [0603]  11.2,34.42 0 top
TERM  569-011x  [569-011X-X00_LED_ARRAY]  15,87.5 0 top
TP1  GND(ISO)  [TESTPOINT_1MM]  104.79,15.71 180 top
TP2  +1.8V(ISO)  [TESTPOINT_1MM]  80.35,20.85 270 top
TP3  +3.3V(ISO)  [TESTPOINT_2MM]  118.2,42.64 270 top
TP4  +5.5V(ISO)  [TESTPOINT_2MM]  108.93,33.16 90 top
TP5  PASS  [TP06R]  71.53,23.84 0 top
TP6  DI1  [TP09SQ]  32.51,75.44 0 top
TP7  DI0  [TP09SQ]  32.51,85.48 0 top
TP8  GND  [TESTPOINT_0.035IN]  37.43,77.12 0 top
TP9  VPROTECT(+4.3V)  [TESTPOINT_0.035IN]  20.58,89.77 90 top
TP10  GND  [TESTPOINT_2MM]  131.8,66.62 0 top
TP11  +3.3V  [TESTPOINT_2MM]  131.8,62.62 0 top
TP12  +12V(FPGA)  [TESTPOINT_2MM]  68.18,105.62 0 top
TP13  +12V(ATX)  [TESTPOINT_2MM]  131.8,58.62 0 top
TP14  GND  [TESTPOINT_2MM]  63.79,105.62 0 top
TP15  GND  [TESTPOINT_2MM]  160.03,16.77 0 top
TP16  GND  [TESTPOINT_2MM]  160.54,106.48 0 top
TP17  GND  [TESTPOINT_2MM]  16.07,108.23 0 top
TP18  GND(ISO)  [TESTPOINT_1MM]  6.18,15.12 0 top
TP19  GND(ISO)  [TESTPOINT_1MM]  38.93,37.87 0 top
TP20  GND(ISO)  [TESTPOINT_1MM]  75.93,20.74 0 top
TP21  GND  [TESTPOINT_2MM]  26.8,61.24 0 top
TP22  +3.3V  [TESTPOINT_2MM]  72.69,105.62 270 top
TP23  GND  [TESTPOINT_1MM]  115.37,51.35 90 top
TP24  SDA  [TESTPOINT_1MM]  112.83,51.35 90 top
TP25  SCL  [TESTPOINT_1MM]  110.29,51.35 90 top
TP26  SCL(ISO)  [TESTPOINT_1MM]  110.29,43.73 270 top
TP27  SDA(ISO)  [TESTPOINT_1MM]  112.83,43.73 270 top
TP28  GND(ISO)  [TESTPOINT_1MM]  115.37,43.73 270 top
TP29  GPIO3  [TP06R]  64.52,32.31 0 top
U1  ISO  [SCREW4]  47.86,33.47 270 top
U2  [JP3]  38.3,80.12 90 top
U3  [JP3]  38.3,69.12 90 top
U4  SN74LVT125  [SO14]  25,51.12 180 top
U5  ADCMP600  [SOT-23-5]  31.55,82.49 180 top
U6  ADCMP600  [SOT-23-5]  31.55,72.49 180 top
U7  [DIP04-SMD]  84.3,28.07 270 top
U8  MCP47FEBX2  [TSSOP-8]  40.55,90.12 270 top
U9  DS90UB914A-Q1  [WQFN48]  69.05,28.49 270 top
U10  LTM4622_BGA  [BGA_5X5_625X625]  98.3,23.77 0 top
U11  ISO1540DR  [SOIC127P500X400-8N]  105.92,47.57 270 top
U12  UEI15-050-Q12P-C  [UEI15]  130,27.32 0 top
U13  ISO7240M  [SOIC_WIDE_16]  57.62,49.7 0 top
U14  ISO7240M  [SOIC_WIDE_16]  69.87,49.7 0 top
U15  ISO7240M  [SOIC_WIDE_16]  82.37,49.7 0 top
U16  ISO7240M  [SOIC_WIDE_16]  94.62,49.7 0 top
U17  ISO7242M  [SOIC_WIDE_16]  45.37,49.7 0 top
U18  COMM  [SCREW4]  57.18,105.49 180 top
U19  SN65LVDT388A  [TSSOP-38]  53.5,65.56 270 top
U20  SN65LVDS387  [TSSOP-64]  75.87,66.7 90 top
U21  SN65LVDS391  [TSSOP-16]  46.87,65.57 90 top
U$2  MOLEX_DUAL_STACKED_VHDCI  [MOLEX_743370911_SD_DUAL_STACKED_VHDCI]  -29.84,68 270 top  (outside the outline)
X1  PCI-MECH_STD-H_HALF-W_FMC-STRAIN  [PCI-ADDIN_STD-H_HALF-L_FMC-STRAIN]  0,4.5 0 top

## Tracks (layer width: path | path; a pad name or v marks a point on that pad's centre or on a via)
2V5_REF
  Top 0.33: R67.1 30.74,89.88 D5.1 | 30.8,89.72 D5.1 | D5.1 30.85,88.44 32.18,87.12 36.38,87.12 U2.3
  Bottom 0.33: U2.3 40.13,85.2 41.43,83.9 41.43,75.59 40.04,74.2 U3.3
$N1
  Top 0.33: R17.2 23.6,69.84 | D4.3 14.61,74.21 R6.2 14.6,73.98 F2.2
  Top 0.381: R17.2 R24.2 R22.2 15.75,69.84 F2.2 | 23.6,69.84 24.75,71 24.75,72 25.75,73 R29.1
$N2
  Top 0.33: 14.6,48.98 R12.2
  Top 0.381: F4.2 14.6,48.98 | 21.19,50.62 19.4,50.62 D2.3 15.34,49.72 R12.2 | 21.19,50.62 24.29,50.62 25,49.91 U4.11 | U4.8 21.19,50.62
$N3
  Top 0.33: F1.2 R5.2 14.61,84.21 D3.3
  Top 0.381: F1.2 15.75,79.84 R16.2 R21.2 R23.2 24.75,81.09 24.75,82 25.75,83 R28.1
$N101
  Top 0.33: F3.2 14.61,55.98 | 26.25,53.7 U4.3
  Top 0.381: 14.61,55.98 R13.2 15.34,52.27 D1.3 19.15,51.62 22.46,51.62 | 22.46,51.62 25.54,51.62 26.25,52.33 26.25,53.7 | U4.6 22.46,51.62
+1V8_ISO  (via drill 0.3, 0.4)
  Top 0.152: 58.3,28.21 R60.1 | R57.1 v59.11,26.34 | R62.1 v59.11,24.68
  Top 0.254: U9.3 v74.3,26.74 | U9.17 v69.8,33.62 | U9.36 v64.05,25.74 | 58.3,28.21 58.3,29.12 56.49,30.93 U1.2 | R60.1 v59.11,28.11
  Route15 0.229: 61.78,24.68 v59.11,24.68 v59.11,26.34 v59.11,28.11
  other vias: 95.93,19.89 94.55,20.02 93.68,18.89 95.18,18.89 94.05,21.89 93.05,20.02 92.43,19.02 69.8,19.49 69.93,18.74 69.55,20.12 69.18,19.49 67.93,18.74 70.93,18.74 68.8,18.74 74.68,26.37 74.55,25.74 73.8,25.87 70.8,33.74 70.93,34.37 69.8,34.24 63.3,25.12 64.05,25.12 63.3,25.74 91.68,19.74 63.68,24.62
  pour Bottom (no thermals): 65.05,26.49 65.05,24.72 64.32,24.37 61.68,24.37 61.68,25.96 62.21,26.49
  pour Bottom (no thermals): 73.3,28.12 73.3,26.35 73.66,25.49 75.18,25.49 75.18,28.12
  pour Bottom (no thermals): 69.55,32.62 71.32,32.62 71.55,33.35 71.55,34.49 69.55,34.49
  pour Bottom (no thermals): 71.3,20.37 67.68,20.37 67.68,18.37 67.8,18.24 71.3,18.24
  pour Top (rank 2, no thermals): 96.3,22.52 91.3,22.52 91.3,16.79 96.3,16.79
  pour Route15 (isolate 0.254, no thermals): 75.3,22.49 96.55,22.49 96.55,14.62 62.8,14.62 62.8,22.87 61.55,24.12 61.55,26.04 62.26,26.74 65.43,26.74 65.43,29.23 69.3,33.11 69.3,34.74 71.93,34.74 71.93,32.87 72.55,32.24 72.65,29.1 73.53,28.24 75.3,28.24
+3V3  (via drill 0.3, 0.4, 0.5)
  Top 0.127: U20.28 81.62,63.68 v81.3,63.99 | U20.5 70.12,63.68 v70.43,63.99 | U20.10 72.62,63.99 v72.68,63.99 | U20.23 79.12,63.99 v79.18,63.99 | 69.08,62.65 U20.3 | U20.30 arc90 82.65,62.62
  Top 0.152: U14.P16 65.42,53.82 65.92,53.32 72.54,53.32 73.04,53.82 U14.P10 | U15.P16 77.92,53.82 78.42,53.32 85.04,53.32 85.54,53.82 U15.P10 | U16.P16 90.17,53.82 90.67,53.32 97.29,53.32 97.79,53.82 U16.P10 | U13.P16 53.17,53.82 53.67,53.32 60.29,53.32 60.79,53.82 U13.P10 | v25.62,59.25 R31.2 | R31.2 | R32.2 v24.3,43.12 | U17.P16 40.92,53.75 41.3,53.37 48.18,53.37 48.55,53.74 48.55,54.77 U17.P10 | C1.2 | U19.33 58.75,63.67 58.55,63.87 58.55,64.74 58.93,65.12 61.18,65.12 v61.55,64.74 | U19.36 U19.37 | U19.22 U19.21 | U20.2 U20.3 | U20.30 U20.31
  Top 0.229: v103.43,55.62 104.47,55.62 R72.2 | v103.43,53.87 104.47,53.87 R71.2
  Top 0.254: R2.2 v19.75,63.5 | U20.16 75.93,62.65 U20.17 | R1.2 v19.75,61.5 | U19.37 60.75,64.19 61.3,64.74 v61.55,64.74 | U19.21 52.75,64.06 53.3,64.62 v53.68,64.62 54.75,64.62 U19.25 | U19.29 56.75,64.37 v56.8,64.37 | v83.18,63.99 83.12,63.93 U20.31 | v68.55,63.99 68.62,63.93 U20.2 | v45.68,64.49 45.01,63.83 44.99,63.83 44.59,63.43 U21.1 | U21.4 46.54,64.36 v46.68,64.49 | U21.8 49.14,64.03 48.68,64.49 v48.05,64.49
  Top 0.33: 32.45,79.5 C8.1 | R67.2 v28.93,92.62
  Top 0.406: U8.1 39.21,91.09 39.69,91.57 C25.2 v39.69,93.49 v39.68,93.49 | v38.68,92.37 39.68,92.37 | v35.05,92.87 C20.2 36.4,90.44 U8.2 | C1.2 C2.2 29.18,50.12 28.81,49.75 U4.14 | v30.3,49.12 C2.2 | v32.18,49.12 C1.2 v33.3,50.12 | U5.5 32.5,79.58 C8.1 32.41,78.38 v32.43,78.37 | U6.5 32.5,69.53 C9.1 32.54,68.38 v32.55,68.37 | U15.P16 77.92,56.39 v77.87,56.45 | U14.P16 65.42,56.39 v65.37,56.45 | U13.P16 53.17,56.27 v52.99,56.45 | v40.74,56.32 40.92,56.14 U17.P16 | U16.P16 90.17,56.39 v90.12,56.45 | 75.93,62.65 v75.93,63.99 | FMC_LPC.P$120 v104.28,104.19 FMC_LPC.P$159 v105.55,105.46 | v105.55,104.19 FMC_LPC.P$118 106.81,102.92 v106.81,102.66 107.83,102.66 FMC_LPC.P$116 | U11.1 v107.83,52.17
  Bottom 0.254: 44.55,64.87 44.55,64.88 | v61.55,64.74 61.55,64.49
  Bottom 0.406: C59.2 77.69,56.63 v77.87,56.45 | C58.2 65.19,56.63 v65.37,56.45 | C57.2 52.94,56.5 v52.99,56.45 | C61.2 40.69,56.38 v40.74,56.32 | C60.2 89.94,56.63 v90.12,56.45 | C91.2 v104.28,104.19 104.81,104.72 C87.+ | C92.2 v105.55,104.19 | v107.83,52.17 C56.2
  pour Bottom (no thermals): 66.68,64.37 66.68,63.12 85.18,63.12 85.18,64.37
  pour Route15 (rank 2, no thermals): -8.7,42.12 32.3,42.12 34.3,44.12 34.3,51.62 36.3,53.62 98.55,53.62 102.8,49.37 122.55,49.37 125.3,46.62 125.3,29.12 132.8,29.12 132.8,14.62 177.34,14.62 177.34,113.72 -8.7,113.72
  pour Bottom (no thermals): 44.43,67.12 44.43,64.24 49.3,64.24 49.3,67.12
  pour Bottom (no thermals): 51.43,65.49 51.43,63.87 63.43,63.87 63.43,65.49
+3V3_ISO  (via drill 0.3, 0.4, 0.5)
  Top 0.152: R14.2 v82.48,32.43 | R18.2 v81.08,32.43 | R15.2 v79.68,32.43 | R19.2 v78.29,32.43 | R65.2 v102.92,41.32 | R66.2 v102.92,39.42
  Top 0.254: U9.20 v68.3,33.74 | U9.29 63.93,29.24 v63.55,29.62 | U9.7 73.93,28.74 v74.43,28.99 | R46.2 v19.18,37.87 | R25.1 60.93,30.25 61.18,30.49 v61.18,31.12 | R75.2 13.13,34.42 v13.18,34.37
  Top 0.406: U17.P1 v40.93,43.12 | U13.P1 53.17,43.49 v52.8,43.12 | U14.P1 65.42,43.36 v65.18,43.12 | U15.P1 77.92,43.36 v77.68,43.12 | U16.P1 90.17,43.49 v89.8,43.12 | U11.8 v107.83,42.76
  Bottom 0.406: v40.93,43.12 40.69,42.88 C54.2 | v52.8,43.12 52.8,42.13 C50.2 | v65.18,43.12 65.18,42.13 C51.2 | v77.68,43.12 77.68,42.13 C52.2 | v89.8,43.12 89.8,42.13 C53.2 | v107.83,42.76 C49.2
  other vias: 75.18,29.74 75.05,29.12 75.68,30.12 61.8,30.74 62.55,30.12 61.55,29.87 63.17,33.5 59.8,32.87 64.43,33.13 62.18,30.99 59.93,31.37 75.68,29.12 92.05,28.37 94.43,29.24 92.55,29.87 94.55,30.74 92.05,30.87 93.3,28.24 95.43,28.37 95.55,30.12 63.81,33.88
  pour Bottom (no thermals): 65.05,29.49 65.05,32.24 65.3,32.49 68.68,32.49 68.68,34.37 59.55,34.37 59.55,29.49
  pour Bottom (no thermals): 73.3,28.87 73.3,30.64 74.03,30.87 75.93,30.87 75.93,28.87
  pour Route15 (rank 2, no thermals): 128.3,14.62 128.3,25.12 121.3,25.12 121.3,43.62 119.3,45.62 40.3,45.62 38.3,43.62 38.3,40.62 36.3,38.62 -9.7,38.62 -9.7,14.62
  pour Top (no thermals): 91.3,24.89 96.18,24.89 96.18,31.39 91.3,31.39
+3V3_ISO_PG
  Top 0.152: 81.12,61.93 U20.27 81.12,61.95 arc90 81.47,61.59 83.85,61.59 83.88,61.62 94.03,61.62 arc-90 96.53,59.12 96.53,56.99 U16.P11
+3V3_ISO_PG_ISO  (via drill 0.3)
  Top 0.152: R56.2 103.18,21.41 103.18,14.49 122.2,14.49 123.55,15.85 v123.55,24.62 | U16.P6 96.55,44.62 v96.55,43.12
  Top 0.254: U10.D4 100.18,21.89 102.67,21.89 R56.2
  Bottom 0.152: v123.55,24.62 123.18,24.99 121.8,24.99 121.55,25.24 121.55,43.36 119.29,45.62 97.55,45.62 96.55,44.62 v96.55,43.12
+3V3_ISO_PG_N  (via drill 0.33)
  Top 0.229: FMC_LPC.P$89 143.65,104.19 143.65,106.03 144.41,106.8 153.88,106.8 155.48,105.19 155.48,103.93 155.2,103.68 154.31,102.79 154.31,100.66 155.51,99.46 155.51,76.59 148.86,69.94 88,69.92 87.62,69.92 87.49,69.79 v86.8,69.09 | v84.1,69.12 83.62,69.6 U20.33
  Bottom 0.229: v86.8,69.09 84.3,69.09 v84.1,69.12
+3V3_ISO_PG_P  (via drill 0.33)
  Top 0.229: FMC_LPC.P$88 144.91,104.19 144.91,105.89 145.47,106.44 153.73,106.44 155.12,105.05 155.12,104.23 153.93,103.04 153.93,100.53 155.15,99.31 155.15,86.03 arc-90 154.88,85.75 154.85,85.75 arc90 154.57,85.48 154.57,84.8 arc90 154.85,84.53 154.88,84.53 arc-90 155.15,84.26 155.15,83.58 arc-90 154.88,83.31 154.85,83.31 arc90 154.57,83.04 154.57,82.36 arc90 154.85,82.09 154.88,82.09 arc-90 155.15,81.82 155.15,81.14 arc-90 154.88,80.87 154.85,80.87 arc90 154.57,80.6 154.57,79.92 arc90 154.85,79.65 154.88,79.65 arc-90 155.15,79.38 155.15,76.82 148.63,70.3 87.4,70.32 86.78,69.7 v86.18,69.7 | U20.34 83.1,70.78 83.1,69.32 v83.2,69.22
  Bottom 0.229: v86.18,69.7 83.68,69.7 v83.2,69.22
+5.5V_ISO  (via drill 0.3, 0.6)
  Bottom 0.406: v97.68,21.89 v97.68,25.64
  other vias: 109.68,25.62 107.43,25.62 108.68,22.99 112.18,23.49 107.18,23.12 109.18,24.12 113.8,24.24 97.55,19.37 98.68,16.87 99.55,19.12 99.3,15.62 100.43,15.12 97.43,16.37 98.18,18.12 112.3,24.99 110.8,26.12 114.93,25.24 115.18,23.62 110.8,24.62 108.3,24.99 113.43,25.37 110.43,23.62 99.43,17.74 97.93,15.24 97.18,17.74 101.3,15.99 107.8,24.12
  pour Top (no thermals): 105.93,19.37 105.93,39.99 121.25,40 121.25,30.5 113.5,30.5 113.5,26.75 115.75,26.75 115.8,19.37
  pour Top (rank 2, no thermals): 102.8,14.62 96.8,14.62 96.8,22.77 99.18,22.77 99.05,20.89 102.8,20.89
  pour Top (rank 2, no thermals): 96.8,24.77 98.55,24.77 98.55,25.27 97.05,26.77 96.8,26.77
  pour Top (no thermals): 11.68,18.12 96.8,18.12 96.8,14.62 11.68,14.62
  pour Route15 (no thermals): 97.18,14.62 97.18,19.37 105.93,19.37 105.93,27.87 116.05,27.87 116.05,14.62
+12V_ATX
  pour Top (isolate 0.254, no thermals): 128.93,48.37 144.8,48.37 146.3,49.87 146.3,54.51 147.53,55.74 150.32,55.74 151.8,54.13 151.8,44.24 150.43,42.87 150.43,27.99 155.05,27.99 155.05,60.49 128.93,60.49
+12V_FPGA  (via drill 0.4, 0.6)
  Top 0.254: TP12.1 68.18,109.39
  Top 0.406: R70.2 R69.2 | FMC_LPC.P$157 v108.08,104.19 | FMC_LPC.P$155 v109.48,104.19
  Top 0.61: v106.81,109.39 68.18,109.39 52.1,109.39 | 52.1,109.39 29.21,109.39 24.68,104.86 R69.2 | U18.3 52.1,109.39
  Bottom 0.406: v108.08,104.19 C82.2 | C80.2 v109.48,104.19 v108.08,104.19 | C66.+ 108.59,104.69 v108.08,104.19
  Bottom 0.61: C66.+ 108.7,108.52 107.83,109.39 v106.81,109.39
BIAS_DI0
  Top 0.33: U8.3 36.81,89.79 36.43,89.4 36.43,88.58 37.13,87.87 40.04,87.87 40.93,86.98 40.93,81.24 39.81,80.12 U2.1
BIAS_DI1
  Top 0.33: U8.4 39.96,89.14 41.93,87.17 41.93,71.24 39.8,69.12 U3.1
BISTEN
  Top 0.152: 77.12,27.99 76.75,27.99 U7.1 | U9.6 76.5,28.24 U7.1 | R19.1 78.29,29.13 77.22,28.07 U7.1
D0
  Top 0.152: 55.68,57.49 55.68,57.37 | 55.68,57.49 55.68,59.62 arc-90 57.68,61.62 67.86,61.62 67.88,61.59 70.4,61.59 arc90 70.62,61.81 70.62,62.52 | 70.62,61.93 70.62,62.52 | 70.62,62.52 U20.6 | U13.P14 55.68,54.78 55.68,57.49
D0_ISO
  Top 0.152: R54.1 63.68,37.54 arc45 63.53,37.89 61.95,39.47 arc45 61.59,39.62 53.38,39.62 arc-90 52.3,40.69 52.3,41.22 arc-90 53.45,42.37 54.84,42.37 arc45 55.2,42.52 55.66,42.97 arc45 55.8,43.33 55.8,44.53 U13.P3
D0_N  (via drill 0.33)
  Top 0.229: FMC_LPC.P$98 v132.22,102.92 | v132.6,97.33 132.6,96.44 132.34,96.19 132.34,94.28 132.27,94.08 132.27,87.67 129.54,84.94 76.38,84.94 75.74,84.31 arc-90 74.85,84.31 arc90 74.47,84.31 74.03,83.87 arc90 74.03,83.49 arc-90 74.03,82.6 71.97,80.54 arc-90 71.08,80.54 arc90 70.7,80.54 70.64,80.48 arc90 70.64,80.09 arc-90 70.64,79.2 70.51,79.08 arc-90 69.62,79.08 arc90 69.24,79.08 69.17,79.02 arc90 69.17,78.63 arc-90 69.17,77.74 68.62,77.18 U20.63
  Bottom 0.229: v132.22,102.92 132.85,102.28 132.85,97.58 v132.6,97.33
D0_P  (via drill 0.33)
  Top 0.229: 68.12,77.19 68.92,77.99 arc90 68.92,78.38 arc-90 68.92,79.27 68.98,79.33 arc-90 69.87,79.33 arc90 70.26,79.33 70.38,79.45 arc90 70.38,79.84 arc-90 70.38,80.73 70.45,80.79 arc-90 71.34,80.79 arc90 71.72,80.79 72.42,81.48 arc90 72.42,81.87 arc-90 72.42,82.26 72.94,82.78 arc-90 73.32,82.78 arc90 73.71,82.78 73.78,82.85 arc90 73.78,83.23 arc-90 73.78,84.12 74.21,84.56 arc-90 75.1,84.56 75.39,84.56 arc45 75.56,84.63 76.23,85.3 129.37,85.3 131.91,87.84 131.91,94.48 131.96,94.66 v131.96,96.69 | FMC_LPC.P$97 132.85,102.28 v132.22,101.65 | U20.64 68.12,77.19 | 68.12,77.19 | 68.12,77.19 68.38,77.44
  Bottom 0.229: v132.22,101.65 132.22,97.96 131.96,97.71 v131.96,96.69
D1
  Top 0.152: 57.05,57.74 57.05,57.6 | 57.05,57.74 57.05,59.12 arc-90 59.18,61.24 70.62,61.24 arc90 71.12,61.74 U20.7 71.12,61.93 | U13.P13 57.05,54.78 57.05,57.74
D1_ISO
  Top 0.152: R38.1 64.8,37.66 arc45 64.66,38.02 62.57,40.1 arc45 62.22,40.24 54.05,40.24 arc-90 53.55,40.74 53.55,41.37 arc-90 54.05,41.87 55.59,41.87 arc45 55.95,42.02 56.84,42.9 arc45 56.98,43.26 U13.P4
D1_N  (via drill 0.33)
  Top 0.229: FMC_LPC.P$17 v133.49,99.11 | v133.61,96.69 133.61,95.93 133.16,95.48 133.16,90.95 arc90 133.43,90.68 arc-90 134.06,90.05 134.06,89.98 arc-90 133.43,89.35 arc90 133.16,89.07 133.16,89 arc90 133.43,88.73 arc-90 134.06,88.1 134.06,88.07 arc-90 133.43,87.44 arc90 133.16,87.17 133.16,87.09 arc90 133.43,86.82 arc-90 134.06,86.19 134.06,86.17 arc-90 133.43,85.54 arc-13 132.47,85.64 arc26 132.22,85.64 arc117 132.22,85.14 arc-66 132.34,84.37 arc-97 131.33,83.99 130.64,83.94 76.88,83.94 69.62,76.68 U20.61
  Bottom 0.229: v133.49,99.11 133.61,98.98 v133.61,96.69
D1_P
  Top 0.229: 69.12,76.69 76.73,84.3 114.36,84.3 115.3,84.3 arc90 115.43,84.43 arc-90 115.55,84.55 116.37,84.55 arc-90 116.49,84.43 arc90 116.62,84.3 117.43,84.3 arc90 117.56,84.43 arc-90 117.69,84.55 118.5,84.55 arc-90 118.63,84.43 arc90 118.75,84.3 119.57,84.3 arc90 119.69,84.43 arc-90 119.82,84.55 120.63,84.55 arc-90 120.76,84.43 arc90 120.89,84.3 121.7,84.3 arc90 121.83,84.43 arc-90 121.95,84.55 122.77,84.55 arc-90 122.89,84.43 arc90 123.02,84.3 123.83,84.3 arc90 123.96,84.43 arc-90 124.09,84.55 124.9,84.55 arc-90 125.03,84.43 arc90 125.15,84.3 125.97,84.3 arc90 126.09,84.43 arc-90 126.22,84.55 127.03,84.55 arc-90 127.16,84.43 arc90 127.29,84.3 128.1,84.3 arc90 128.23,84.43 128.23,84.45 arc-90 128.33,84.55 129.17,84.55 arc-90 129.29,84.43 arc90 129.42,84.3 130.46,84.3 130.62,84.46 arc-32 130.77,84.5 131.33,84.5 arc185 131.83,84.88 arc-154 132.47,86.03 arc16 133.43,85.89 arc90 133.7,86.17 133.7,86.19 arc90 133.43,86.47 arc-90 132.8,87.09 132.8,87.17 arc-90 133.43,87.8 arc90 133.7,88.07 133.7,88.1 arc90 133.43,88.37 arc-90 132.8,89 132.8,89.07 arc-90 133.43,89.7 arc90 133.7,89.98 133.7,90.05 arc90 133.43,90.33 arc-90 132.8,90.95 132.8,96.01 133.1,96.31 133.1,97.46 FMC_LPC.P$16 | U20.62 69.12,76.69 | 69.12,76.69 | 69.12,76.69 69.58,77.14
D2
  Top 0.152: 58.43,57.99 58.43,57.71 | 58.43,57.99 58.43,60.14 arc-90 59.16,60.87 71.12,60.87 arc90 71.62,61.37 U20.8 | U13.P12 58.43,54.78 58.43,57.99
D2_ISO
  Top 0.152: U13.P5 58.3,44.57 58.3,42.58 arc-45 58.16,42.22 57.57,41.64 arc-45 57.22,41.49 55.37,41.49 arc90 55.05,41.18 55.05,40.94 arc90 55.37,40.62 62.59,40.62 arc-45 62.95,40.47 65.78,37.64 arc-45 65.93,37.29 R45.1
D2_N
  Top 0.229: FMC_LPC.P$56 134.75,98.48 134.75,96.69 134.93,96.13 134.93,95.99 arc-90 134.3,95.36 arc90 134.03,95.09 134.03,95.06 arc90 134.3,94.78 arc-90 134.93,94.15 134.93,94.17 arc-90 134.3,93.54 arc90 134.03,93.27 134.03,93.28 arc90 134.3,93 | 134.3,93 arc-90 134.93,92.38 | 134.3,93 arc-90 134.93,92.38 | 134.93,92.38 134.93,92.39 arc-90 134.3,91.76 arc90 134.03,91.49 134.03,91.5 arc90 134.3,91.23 arc-90 134.93,90.6 134.93,85.48 134.43,84.97 arc90 134.43,84.55 134.87,84.11 arc-90 134.87,83.69 134.09,82.92 arc-90 133.67,82.92 133.23,83.36 arc90 132.81,83.36 132.39,82.94 77.38,82.94 70.62,76.18 U20.59
D2_P  (via drill 0.33)
  Top 0.229: FMC_LPC.P$55 135.39,100.09 134.85,100.63 v134.37,100.63 | v134.12,97.58 134.25,97.46 134.25,96.57 134.58,95.99 134.58,95.99 arc-90 134.3,95.72 arc90 133.68,95.09 133.68,95.06 arc90 134.3,94.43 arc-90 134.58,94.15 134.58,94.17 arc-90 134.3,93.9 arc90 133.68,93.27 133.68,93.28 arc90 134.3,92.65 | 134.3,92.65 arc-90 134.58,92.38 | 134.3,92.65 arc-90 134.58,92.38 | 134.58,92.38 134.58,92.39 arc-90 134.3,92.12 arc90 133.68,91.49 133.68,91.5 arc90 134.3,90.87 arc-90 134.58,90.6 134.58,85.66 132.22,83.3 77.23,83.3 70.12,76.19 U20.60
  Bottom 0.229: v134.37,100.63 134.12,100.38 v134.12,97.58
D3
  Top 0.152: U20.9 72.12,60.99 arc-90 71.62,60.49 60.35,60.49 arc90 59.55,59.69 59.55,54.78 U13.P11
D3_ISO
  Top 0.152: R53.1 67.05,38.86 arc90 66.17,39.74 65.53,39.74 arc-90 64.55,40.72 64.55,44.51 arc90 63.82,45.24 63.53,45.24 arc90 62.8,44.51 62.8,42.29 arc-90 62,41.49 60.34,41.49 arc-90 59.52,42.32 U13.P6
D3_N  (via drill 0.33)
  Top 0.229: FMC_LPC.P$135 v136.03,104.19 | v135.77,96.82 135.77,96.44 135.69,96.36 135.69,90.61 arc90 135.97,90.34 arc-90 136.24,90.06 136.24,90.03 arc-90 135.97,89.76 arc90 135.69,89.48 135.69,87.93 arc90 135.97,87.65 arc-90 136.24,87.38 136.24,87.35 arc-90 135.97,87.08 arc90 135.69,86.8 135.69,86.77 arc90 135.97,86.5 arc-90 136.24,86.22 136.24,86.19 arc-90 135.97,85.92 arc90 135.69,85.64 135.69,83.23 134.41,81.94 77.88,81.94 71.62,75.68 U20.57
  Bottom 0.229: v136.03,104.19 135.26,103.42 135.26,102.15 136.15,101.27 136.15,97.2 v135.77,96.82
D3_P  (via drill 0.33)
  Top 0.229: FMC_LPC.P$134 136.03,105.46 135.12,105.46 134.75,105.1 134.75,101.77 v135.01,101.52 | v135.26,97.33 135.26,96.44 135.34,96.36 135.34,83.45 134.19,82.3 77.73,82.3 71.12,75.69 U20.58
  Bottom 0.229: v135.01,101.52 135.77,100.76 135.77,97.83 v135.26,97.33
D4
  Top 0.152: U20.11 73.05,62.65 73.05,61.09 arc-90 72.08,60.12 64.2,60.12 arc90 63.3,59.22 63.3,58 arc90 64.19,57.12 67.37,57.12 arc-90 67.96,56.53 U14.P14
D4_ISO
  Top 0.152: U14.P3 67.96,43.24 arc-90 67.21,42.49 65.55,42.49 arc90 65.05,41.99 65.05,41.49 arc90 65.55,40.99 71.07,40.99 arc-90 71.43,40.64 71.43,40.57 arc-90 70.98,40.12 68.28,40.12 arc90 67.55,39.39 67.55,38.59 arc90 67.9,38.24 arc-90 68.18,37.96 R37.1
D4_N  (via drill 0.33)
  Top 0.229: FMC_LPC.P$95 v136.03,102.92 | v136.91,97.2 136.91,96.31 136.97,96.36 136.97,83.3 134.6,80.94 78.38,80.94 72.62,75.18 U20.55
  Bottom 0.229: v136.03,102.92 136.79,102.15 136.79,97.33 v136.91,97.2
D4_P
  Top 0.229: FMC_LPC.P$94 136.66,102.79 136.03,102.15 136.03,97.96 136.41,97.58 136.41,96.32 136.61,96.11 136.61,95.56 arc-90 136.34,95.29 arc90 136.06,95.02 136.06,94.19 arc90 136.34,93.92 arc-90 136.61,93.65 136.61,83.52 134.39,81.3 78.23,81.3 72.12,75.19 U20.56
D5
  Top 0.152: U20.12 73.62,60.76 arc-90 72.6,59.74 65,59.74 arc90 64.55,59.29 arc90 64.98,58.87 68.75,58.87 arc-90 69.25,58.37 69.25,57.74 69.25,54.78 U14.P13
D5_ISO
  Top 0.152: U14.P4 69.3,44.55 69.3,42.92 arc-90 68.5,42.12 66.36,42.12 arc90 66.05,41.81 arc90 66.37,41.49 72.26,41.49 arc-90 72.8,40.95 arc-45 72.66,40.6 71.95,39.89 arc-45 71.59,39.74 70.01,39.74 arc90 69.3,39.04 R44.1
D5_N  (via drill 0.33)
  Top 0.229: FMC_LPC.P$14 v137.29,99.11 | v137.93,97.46 137.93,96.44 137.85,96.36 137.85,95.2 arc90 138.13,94.92 arc-90 138.76,94.3 138.76,94.29 arc-90 138.13,93.66 arc90 137.85,93.39 137.85,93.36 arc90 138.13,93.09 arc-90 138.76,92.46 138.76,92.39 arc-90 138.13,91.76 arc90 137.85,91.49 137.85,91.44 arc90 138.13,91.17 arc-90 138.76,90.54 138.76,90.48 arc-90 138.13,89.85 arc90 137.85,89.58 137.85,89.53 arc90 138.13,89.26 arc-90 138.76,88.63 138.76,88.58 arc-90 138.13,87.95 arc90 137.85,87.68 137.85,87.62 arc90 138.13,87.35 arc-90 138.76,86.72 138.76,83.38 135.31,79.94 78.88,79.94 73.62,74.68 U20.53
  Bottom 0.229: v137.29,99.11 137.93,98.47 v137.93,97.46
D5_P
  Top 0.229: FMC_LPC.P$13 137.42,97.96 137.42,96.44 137.5,96.36 137.5,95.2 arc90 138.13,94.57 arc-90 138.4,94.3 138.4,94.29 arc-90 138.13,94.02 arc90 137.5,93.39 137.5,93.36 arc90 138.13,92.73 arc-90 138.4,92.46 138.4,92.39 arc-90 138.13,92.12 arc90 137.5,91.49 137.5,91.44 arc90 138.13,90.81 arc-90 138.4,90.54 138.4,90.48 arc-90 138.13,90.21 arc90 137.5,89.58 137.5,89.53 arc90 138.13,88.9 arc-90 138.4,88.63 138.4,88.58 arc-90 138.13,88.31 arc90 137.5,87.68 137.5,87.62 arc90 138.13,87 arc-90 138.4,86.72 138.4,86.67 arc-90 138.13,86.4 arc90 137.5,85.77 137.5,85.74 arc90 138.13,85.12 arc-90 138.4,84.84 138.4,83.56 135.13,80.3 78.73,80.3 73.12,74.69 U20.54
D6
  Top 0.152: U20.13 74.12,61.6 arc-45 74.09,61.53 arc45 74.05,61.44 74.05,58.49 arc90 74.55,57.99 75.52,57.99 arc-90 76.05,57.46 76.05,55.96 arc-90 75.71,55.62 arc-90 75.43,55.9 75.43,56.92 arc90 74.98,57.37 73.3,57.37 arc-90 72.8,57.87 72.8,58.87 arc90 72.3,59.37 71,59.37 arc90 70.5,58.87 70.5,56.96 U14.P12
D6_ISO
  Top 0.152: R52.1 70.43,37.54 arc-45 70.57,37.89 72.16,39.47 arc-45 72.51,39.62 73.58,39.62 arc45 73.94,39.77 76.22,42.05 arc45 76.41,42.49 76.41,44.06 arc90 75.97,44.49 75.88,44.49 arc90 75.43,44.04 75.43,42.52 arc-90 74.9,41.99 70.95,41.99 arc-45 70.7,42.1 arc-45 70.55,42.45 70.55,44.57 U14.P5
D6_N
  Top 0.229: FMC_LPC.P$53 137.93,99.61 138.06,99.61 138.56,99.11 138.56,97.71 139.07,97.2 139.07,96.44 139.38,96.13 139.38,95.54 139.65,94.92 arc-90 140.28,94.3 140.28,94.29 arc-90 139.65,93.66 arc90 139.38,93.39 139.38,93.36 arc90 139.65,93.09 arc-90 140.28,92.46 140.28,92.39 arc-90 139.65,91.76 arc90 139.38,91.49 139.38,91.44 arc90 139.65,91.17 arc-90 140.28,90.54 140.28,90.48 arc-90 139.65,89.85 arc90 139.38,89.58 139.38,89.54 | 139.38,89.54 139.38,89.53 | 139.38,89.54 arc90 139.65,89.26 arc-90 140.28,88.64 140.28,88.23 arc-45 140.2,88.04 139.89,87.73 arc45 139.76,87.41 139.76,81.67 137.03,78.94 79.38,78.94 74.62,74.18 U20.51
D6_P  (via drill 0.33)
  Top 0.229: FMC_LPC.P$52 v138.56,100.38 | v138.56,96.82 138.56,96.44 139.02,95.98 139.02,95.2 | 139.02,95.2 arc90 139.65,94.57 arc-90 139.92,94.3 139.92,94.29 arc-90 139.65,94.02 arc90 139.02,93.39 139.02,93.36 arc90 139.65,92.73 arc-90 139.92,92.46 139.92,92.39 arc-90 139.65,92.12 arc90 139.02,91.49 139.02,91.44 arc90 139.65,90.81 arc-90 139.92,90.54 139.92,90.48 arc-90 139.65,90.21 arc90 139.02,89.58 139.02,89.54 | 139.02,89.54 139.02,89.53 | 139.02,95.17 139.02,95.2 | 139.02,89.54 arc90 139.65,88.91 arc-90 139.8,88.38 139.51,87.97 arc45 139.4,87.71 139.4,81.84 136.86,79.3 79.23,79.3 74.12,74.19 U20.52
  Bottom 0.229: v138.56,100.38 v138.56,96.82
D7
  Top 0.152: U14.P11 71.77,56.62 arc-90 72.11,56.96 74.42,56.96 arc-90 74.93,56.45 74.93,53.99 arc90 75.43,53.49 76.18,53.49 arc90 76.68,53.99 76.68,57.99 arc90 76.18,58.49 74.93,58.49 arc-90 74.43,58.99 74.43,61.25 arc-45 74.51,61.45 arc45 74.62,61.71 U20.14
D7_ISO
  Top 0.152: R36.1 71.55,37.41 arc-45 71.7,37.77 72.91,38.97 arc-45 73.26,39.12 73.91,39.12 arc45 74.27,39.27 76.91,41.9 arc45 77.05,42.26 77.05,44.49 arc90 76.55,44.99 75.46,44.99 arc90 74.93,44.46 74.93,43.2 arc-90 74.22,42.49 72.27,42.49 arc-90 71.77,42.99 U14.P6
D7_N  (via drill 0.33)
  Top 0.229: FMC_LPC.P$92 v139.71,103.04 | v140.47,96.95 140.47,96.31 141.03,95.75 141.03,80.59 138.38,77.94 79.88,77.94 75.62,73.68 U20.49
  Bottom 0.229: v139.71,103.04 140.47,102.28 v140.47,96.95
D7_P
  Top 0.229: FMC_LPC.P$91 140.47,102.66 139.84,102.03 139.84,96.19 140.67,95.35 140.67,87.4 arc-90 140.4,87.13 arc90 140.13,86.86 140.13,85.56 arc90 140.4,85.28 arc-90 140.67,85.01 140.67,80.84 138.13,78.3 79.73,78.3 75.12,73.69 U20.50
D8
  Top 0.152: U15.P14 80.46,56.82 80.46,56.92 arc90 80.27,57.12 77.6,57.12 arc-90 77.18,57.54 arc-90 77.63,57.99 79.28,57.99 arc90 79.8,58.52 arc90 79.45,58.87 75.33,58.87 arc-90 74.8,59.4 74.8,61.04 arc-90 75.25,61.49 76.8,61.49 arc90 77.12,61.81 U20.19
D8_ISO
  Top 0.152: R43.1 72.68,37.29 arc-45 72.82,37.64 73.66,38.47 arc-45 74.01,38.62 74.47,38.62 arc45 74.82,38.77 76.78,40.72 arc-45 77.13,40.87 83.36,40.87 arc90 83.68,41.19 83.68,41.3 arc90 83.36,41.62 81.05,41.62 arc-90 80.55,42.12 80.55,44.53 U15.P3
D8_N  (via drill 0.33)
  Top 0.229: FMC_LPC.P$11 v141.1,99.11 | v141.87,96.95 141.87,96.44 141.79,96.36 141.79,95.38 arc90 142.06,95.11 arc-90 142.69,94.48 142.69,94.17 arc-90 142.06,93.54 arc90 141.79,93.26 141.79,92.89 arc90 142.06,92.62 arc-90 142.69,91.99 142.69,91.75 arc-90 142.06,91.12 arc90 141.79,90.85 141.79,90.69 arc90 142.06,90.42 arc-90 142.69,89.79 142.69,89.59 arc-90 142.06,88.97 arc90 141.79,88.69 141.79,88.65 arc90 142.06,88.38 arc-90 142.69,87.75 142.68,80.48 139.14,76.94 80.38,76.94 76.62,73.18 U20.47
  Bottom 0.229: v141.1,99.11 141.1,97.71 v141.87,96.95
D8_P
  Top 0.229: FMC_LPC.P$10 141.36,98.09 141.36,96.44 141.44,96.36 141.44,95.38 arc90 142.06,94.75 arc-90 142.34,94.48 142.34,94.17 arc-90 142.06,93.89 arc90 141.44,93.26 141.44,92.89 arc90 142.06,92.26 arc-90 142.34,91.99 142.34,91.75 arc-90 142.06,91.48 arc90 141.44,90.85 141.44,90.69 arc90 142.06,90.07 arc-90 142.34,89.79 142.34,89.59 arc-90 142.06,89.32 arc90 141.44,88.69 141.44,88.65 arc90 142.06,88.03 arc-90 142.34,87.75 142.32,87.33 arc-90 142.05,87.05 arc90 141.78,86.78 141.78,86.65 arc90 142.05,86.38 arc-90 142.32,86.1 142.32,85.98 arc-90 142.05,85.7 arc90 141.78,85.43 141.78,85.3 arc90 142.05,85.03 arc-90 142.32,84.76 142.32,80.73 138.9,77.3 80.23,77.3 76.12,73.19 U20.48
D9
  Top 0.152: 81.75,57.72 81.75,58.87 arc90 81.25,59.37 75.58,59.37 arc-90 75.3,59.65 75.3,59.71 arc-90 75.58,59.99 77.46,59.99 arc90 77.68,60.21 arc90 77.4,60.49 75.58,60.49 arc-90 75.3,60.77 arc-90 75.52,60.99 77.13,60.99 arc90 77.62,61.48 U20.20 | 81.75,57.72 81.75,57.71 | U15.P13 81.75,54.78 81.75,57.72
D9_ISO
  Top 0.152: R51.1 73.8,37.37 74.41,37.97 arc-45 74.76,38.12 74.84,38.12 arc45 75.2,38.27 77.16,40.22 arc-45 77.51,40.37 83.82,40.37 arc90 84.55,41.1 84.55,41.39 arc90 83.82,42.12 82.23,42.12 arc-90 81.73,42.62 U15.P4
D9_N  (via drill 0.33)
  Top 0.229: FMC_LPC.P$131 v141.1,104.19 | v143.14,96.69 144.08,95.75 144.08,78.57 141.45,75.94 80.88,75.94 77.62,72.68 U20.45
  Bottom 0.229: v143.14,96.69 143.14,102.15 v141.1,104.19
D9_P  (via drill 0.33)
  Top 0.229: FMC_LPC.P$130 142.38,104.19 v142.38,101.9 | v142.5,97.84 142.5,96.57 143.72,95.35 143.72,83.87 arc-90 143.45,83.59 arc90 143.18,83.32 143.18,82.38 arc90 143.45,82.11 arc-90 143.72,81.83 143.72,78.84 141.18,76.3 80.73,76.3 77.12,72.69 U20.46
  Bottom 0.229: 142.38,97.96 v142.5,97.84 141.87,98.47 141.87,101.39 v142.38,101.9
D10
  Top 0.152: U20.21 78.12,60.24 arc90 78.62,59.74 86.3,59.74 arc-90 86.8,59.24 86.8,58.74 arc-90 86.3,58.24 85.65,58.24 arc-90 85.3,58.59 arc90 85.02,58.87 83.4,58.87 arc90 82.95,58.42 82.95,57.27 82.95,54.83 U15.P12
D10_ISO
  Top 0.152: R35.1 74.93,37.24 77.16,39.47 arc-45 77.51,39.62 84.63,39.62 arc90 85.43,40.42 85.43,41.89 arc90 84.7,42.62 83.5,42.62 arc-90 83,43.12 U15.P5
D10_N  (via drill 0.33)
  Top 0.229: FMC_LPC.P$50 142.5,100.5 v143.65,100.5 | v144.15,97.2 145.35,96.01 145.35,77.68 142.61,74.94 81.38,74.94 78.62,72.18 U20.43
  Bottom 0.229: v143.65,100.5 144.15,100 v144.15,97.2
D10_P
  Top 0.229: FMC_LPC.P$49 143.65,99.11 143.65,96.82 144.99,95.47 144.99,89.69 arc-90 144.72,89.42 arc90 144.44,89.14 144.44,88.99 arc90 144.72,88.72 arc-90 144.99,88.45 144.99,88.29 arc-90 144.72,88.02 arc90 144.44,87.75 144.44,87.59 arc90 144.72,87.32 arc-90 144.99,87.05 144.99,86.89 arc-90 144.72,86.62 arc90 144.44,86.35 144.44,86.19 arc90 144.72,85.92 arc-90 144.99,85.65 144.99,85.49 arc-90 144.72,85.22 arc90 144.44,84.95 144.44,84.79 arc90 144.72,84.52 arc-90 144.99,84.25 144.99,77.84 142.45,75.3 81.23,75.3 78.12,72.19 U20.44
D11